# Altium project DriverBoard.PrjPcb
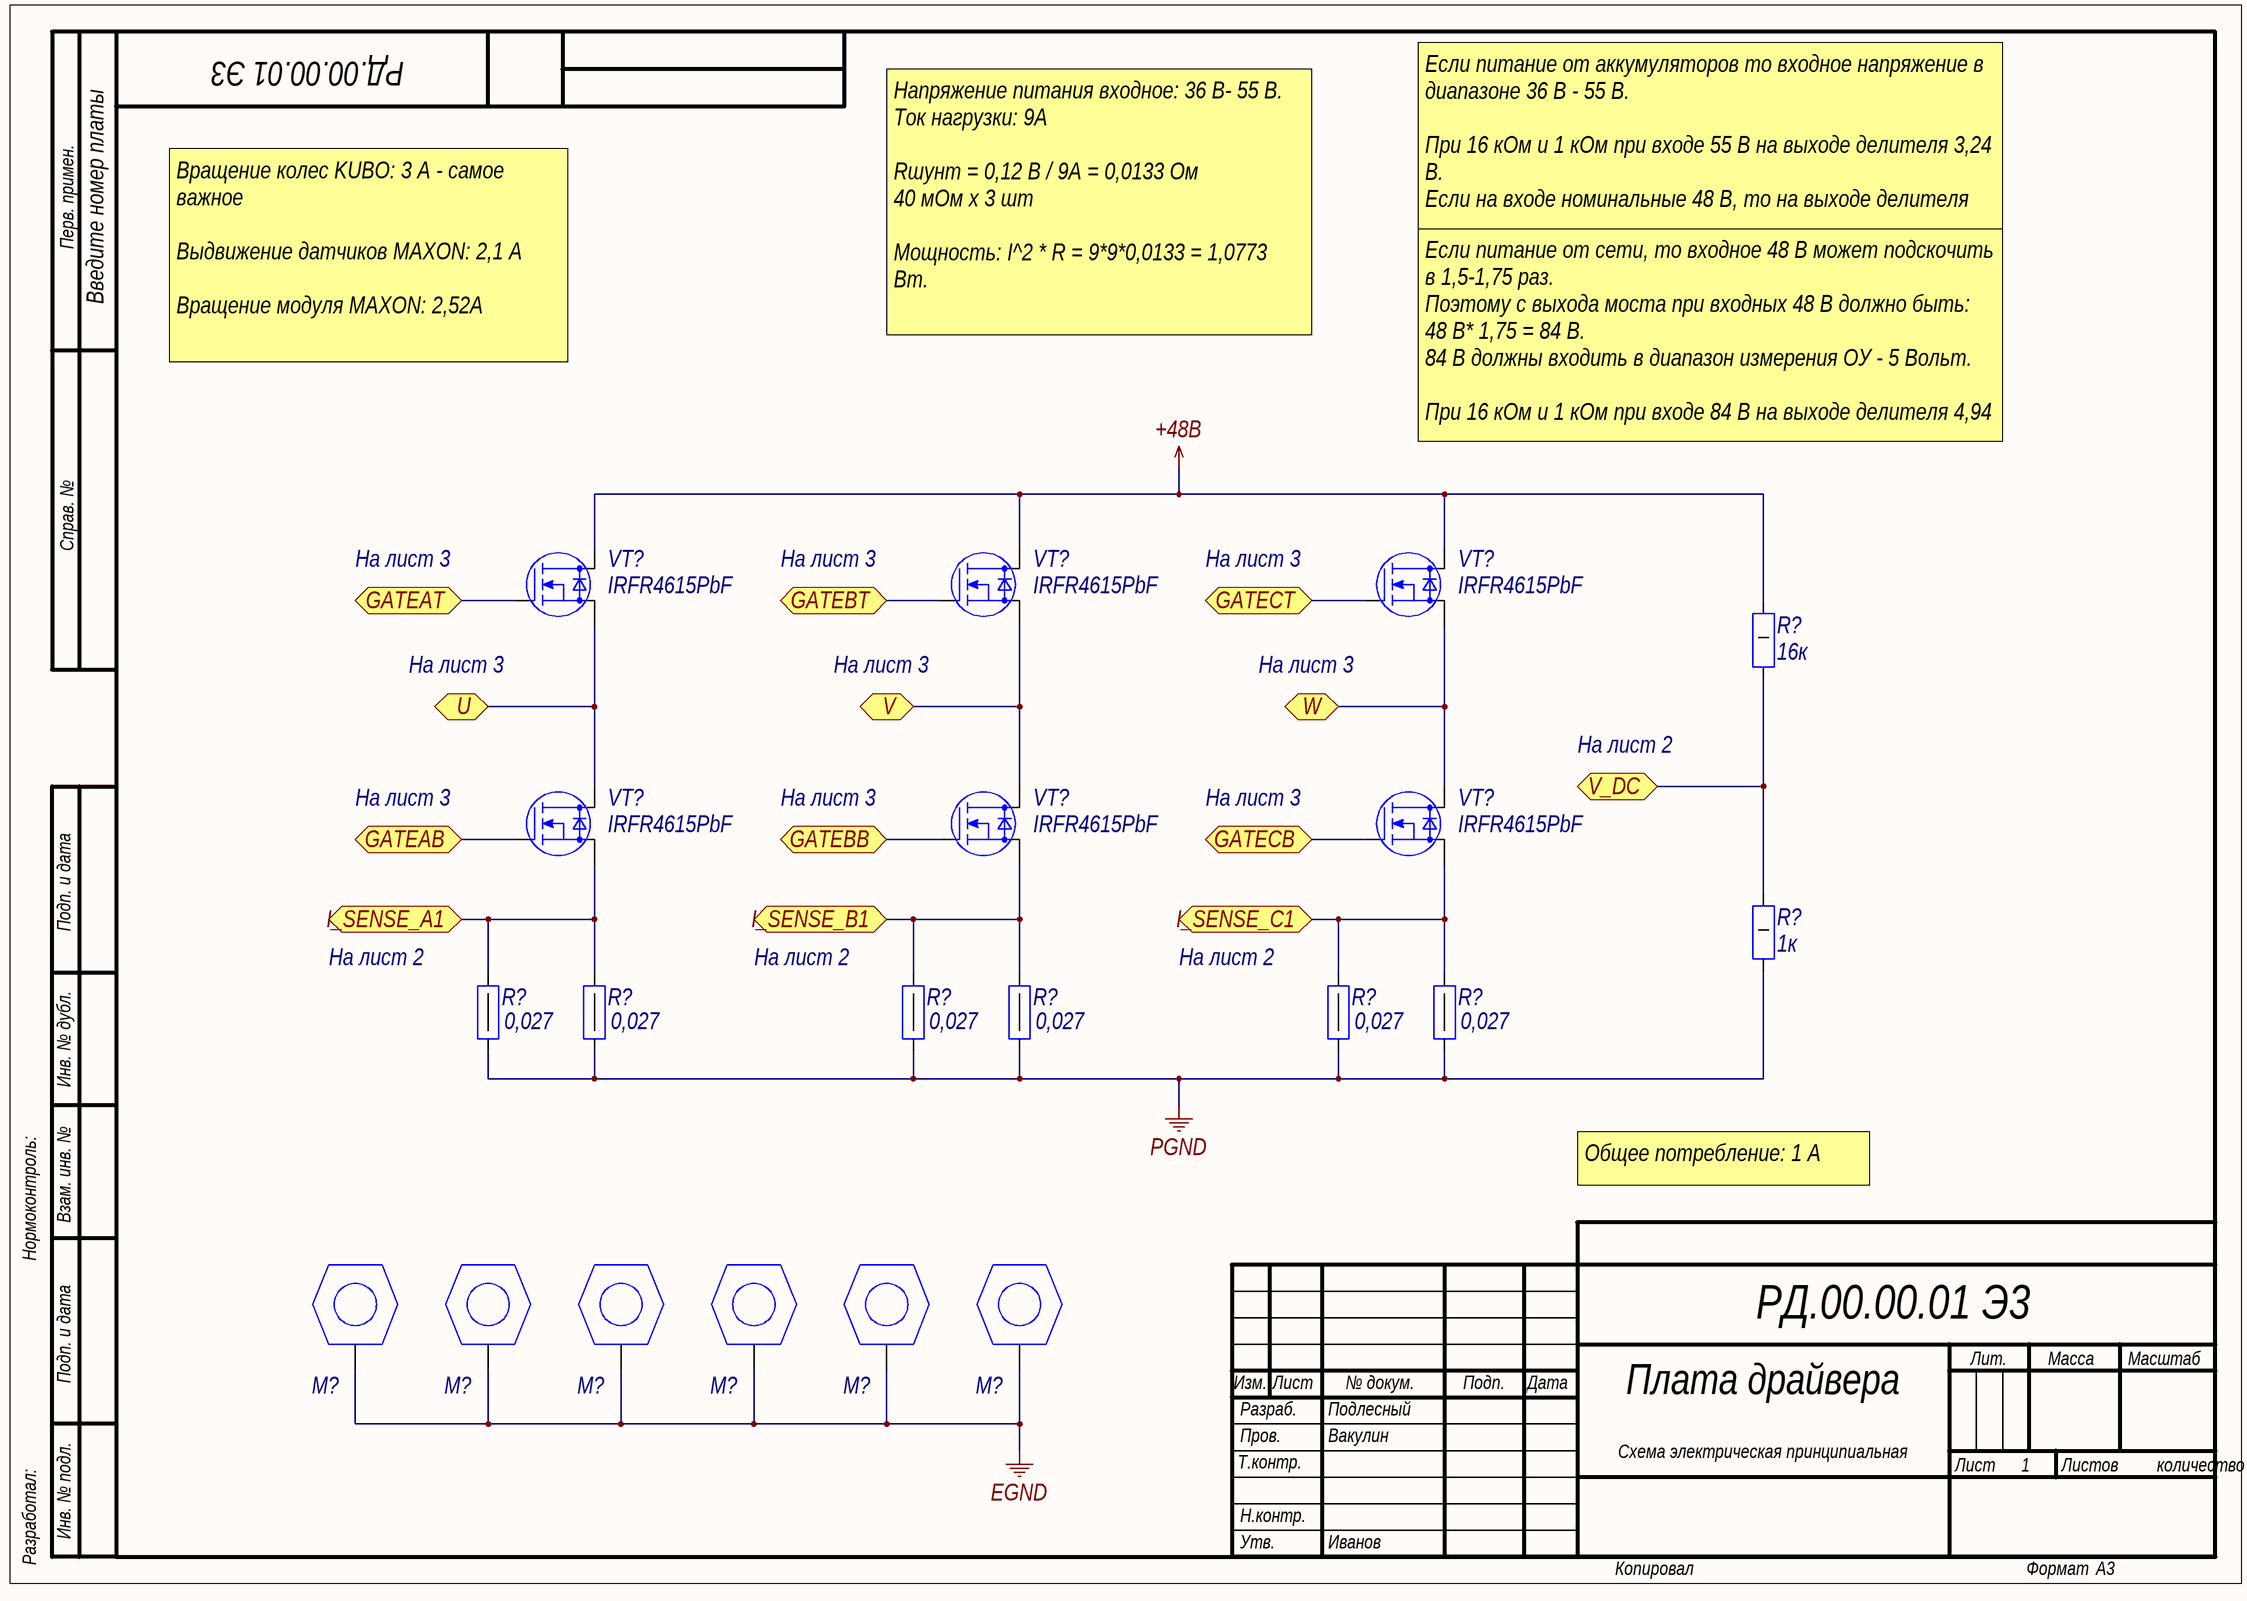
[diagram p0: DriverBoard_Bridge.SchDoc]
5 sheets, 143 parts. Net scope: flat (ports and power ports of the same name join across sheets).
Board file: DriverBoard.PcbDoc
Sheets:
  DriverBoard_Bridge.SchDoc
  DriverBoard_Amp.SchDoc
  DriverBoard_Driver.SchDoc
  DriverBoard_MCU.SchDoc
  DriverBoard_DC.SchDoc

## Sheet DriverBoard_Bridge.SchDoc: Плата драйвера
size 420 x 297 mm; ApprovedBy: Иванов; CheckedBy: Вакулин; DrawnBy: Подлесный; DocumentNumber: РД.00.00.01 Э3; SheetNumber: 1; SheetTotal: количество листов; DocumentType: Схема электрическая принципиальная; Format: A3; ImagePath: Введите номер платы

### Parts
(Parts that share a designator on the sheet are numbered #1, #2 ... from top to bottom, then left to right.)
M?#1  SCREW  [SCREW3]  (value not drawn)
M?#2  SCREW  [SCREW3]  (value not drawn)
M?#3  SCREW  [SCREW3]  (value not drawn)
M?#4  SCREW  [SCREW3]  (value not drawn)
M?#5  SCREW  [SCREW3]  (value not drawn)
M?#6  SCREW  [SCREW3]  (value not drawn)
R?#1  value 16к  [R2512]  (hidden comment: Resistor_1Вт)
R?#2  value 1к  [R2512]  (hidden comment: Resistor_1Вт)
R?#3  value 0,027  [R2010]  (hidden comment: Resistor_0,5Вт)
R?#4  value 0,027  [R2010]  (hidden comment: Resistor_0,5Вт)
R?#5  value 0,027  [R2010]  (hidden comment: Resistor_0,5Вт)
R?#6  value 0,027  [R2010]  (hidden comment: Resistor_0,5Вт)
R?#7  value 0,027  [R2010]  (hidden comment: Resistor_0,5Вт)
R?#8  value 0,027  [R2010]  (hidden comment: Resistor_0,5Вт)
VT?#1  Part Number: IRFR4615PbF  [DPAK]  (hidden comment: N-MOSFET)
VT?#2  Part Number: IRFR4615PbF  [DPAK]  (hidden comment: N-MOSFET)
VT?#3  Part Number: IRFR4615PbF  [DPAK]  (hidden comment: N-MOSFET)
VT?#4  Part Number: IRFR4615PbF  [DPAK]  (hidden comment: N-MOSFET)
VT?#5  Part Number: IRFR4615PbF  [DPAK]  (hidden comment: N-MOSFET)
VT?#6  Part Number: IRFR4615PbF  [DPAK]  (hidden comment: N-MOSFET)

### Ports
GATEAB, GATEAT, GATEBB, GATEBT, GATECB, GATECT, I_SENSE_A1, I_SENSE_B1, I_SENSE_C1, U, V, V_DC, W

### Nets
+48B: R?#1.2 VT?#1.2(D) VT?#2.2(D) VT?#3.2(D)
EGND: M?#1.1 M?#2.1 M?#3.1 M?#4.1 M?#5.1 M?#6.1
PGND: R?#2.1 R?#3.1 R?#4.1 R?#5.1 R?#6.1 R?#7.1 R?#8.1
NetC?#20_2: VT?#1.3(S) VT?#4.2(D) ; port U
NetC?#23_2: VT?#2.3(S) VT?#5.2(D) ; port V
NetC?#26_2: VT?#3.3(S) VT?#6.2(D) ; port W
NetR?#1_1: R?#1.1 R?#2.2 ; port V_DC
NetR?#3_2: R?#3.2 R?#4.2 VT?#4.3(S) ; port I_SENSE_A1
NetR?#5_2: R?#5.2 R?#6.2 VT?#5.3(S) ; port I_SENSE_B1
NetR?#7_2: R?#7.2 R?#8.2 VT?#6.3(S) ; port I_SENSE_C1
NetR?#29_2: VT?#1.1(G) ; port GATEAT
NetR?#30_2: VT?#4.1(G) ; port GATEAB
NetR?#33_2: VT?#2.1(G) ; port GATEBT
NetR?#34_2: VT?#5.1(G) ; port GATEBB
NetR?#37_2: VT?#3.1(G) ; port GATECT
NetR?#38_2: VT?#6.1(G) ; port GATECB

### Notes on the sheet
- Перв. примен.
- Если питание от аккумуляторов то входное напряжение в диапазоне 36 В - 55 B.
  При 16 кОм и 1 кОм при входе 55 В на выходе делителя 3,24 В.
  Если на входе номинальные 48 В, то на выходе делителя 2,82 В.
  Если на входе 36 В, то на выходе делителя 2,12 В.
- Напряжение питания входное: 36 B- 55 В.
  Ток нагрузки: 9А
  Rшунт = 0,12 B / 9A = 0,0133 Ом
  40 мОм х 3 шт
  Мощность: I^2 * R = 9*9*0,0133 = 1,0773 Вт.
- Вращение колес KUBO: 3 А - самое важное
  Выдвижение датчиков MAXON: 2,1 А
  Вращение модуля MAXON: 2,52А
  Выдвижение УЗ датчика MAXON: 0,748А
- Если питание от сети, то входное 48 В может подскочить в 1,5-1,75 раз.
  Поэтому с выхода моста при входных 48 В должно быть:
  48 В* 1,75 = 84 В.
  84 В должны входить в диапазон измерения ОУ - 5 Вольт.
  При 16 кОм и 1 кОм при входе 84 В на выходе делителя 4,94 В.
- Справ. №
- На лист 3
- (near VT?#1) На лист 3
- (near VT?#2) На лист 3
- (near VT?#3) На лист 3
- На лист 2
- Подп. и дата
- (near R?#3) На лист 2
- (near R?#5) На лист 2
- (near R?#7) На лист 2
- Инв. № дубл.
- Нормоконтроль:
- Взам. инв. №
- Общее потребление: 1 A
- Изм.
- Лист
- № докум.
- Подп.
- Дата
- Лит.
- Масса
- Масштаб
- Т.контр.
- Пров.
- Разраб.
- Листов
- Разработал:
- Инв. № подл.
- Н.контр.
- Утв.
- Копировал
- Формат

### Library data of the parts
M?#1-M?#6 = connect89: Part Name: Винт М3 с заземлением; id: connect89
R?#1 = res879: Резистор; Manufacture: Yageo; Part Number: RC2512FR-0716KL; id: res879; Accuracy: 0,01; Power: 1Вт; Part Name: Resistor
R?#2 = res850: Резистор; Manufacture: Yageo; Part Number: RC2512FR-071KL; id: res850; Accuracy: 0,01; Power: 1Вт; Part Name: Resistor
R?#3-R?#8 = res1151: Резистор; Part Name: Shunt; Manufacture: Yageo; Part Number: RL2010FK-070R027L; Accuracy: 0,01; Power: 0,75Вт; id: res1151
VT?#1-VT?#6 = mosfert20: Manufacturer: International Rectifier; Structure: n-channel; V drain-source max: 150B; Rds: 0,042Ohm; Gate-to-source voltage: (+-)20B; Continuous drain current: 33A; Total gate charge: 26nC; Pulsed drain current: 140A; Power dissipation: 144W; id: mosfert20

## Sheet DriverBoard_Amp.SchDoc
size 594 x 420 mm; DocumentNumber: РД.00.00.01 Э3; SheetNumber: 2; Format: A2
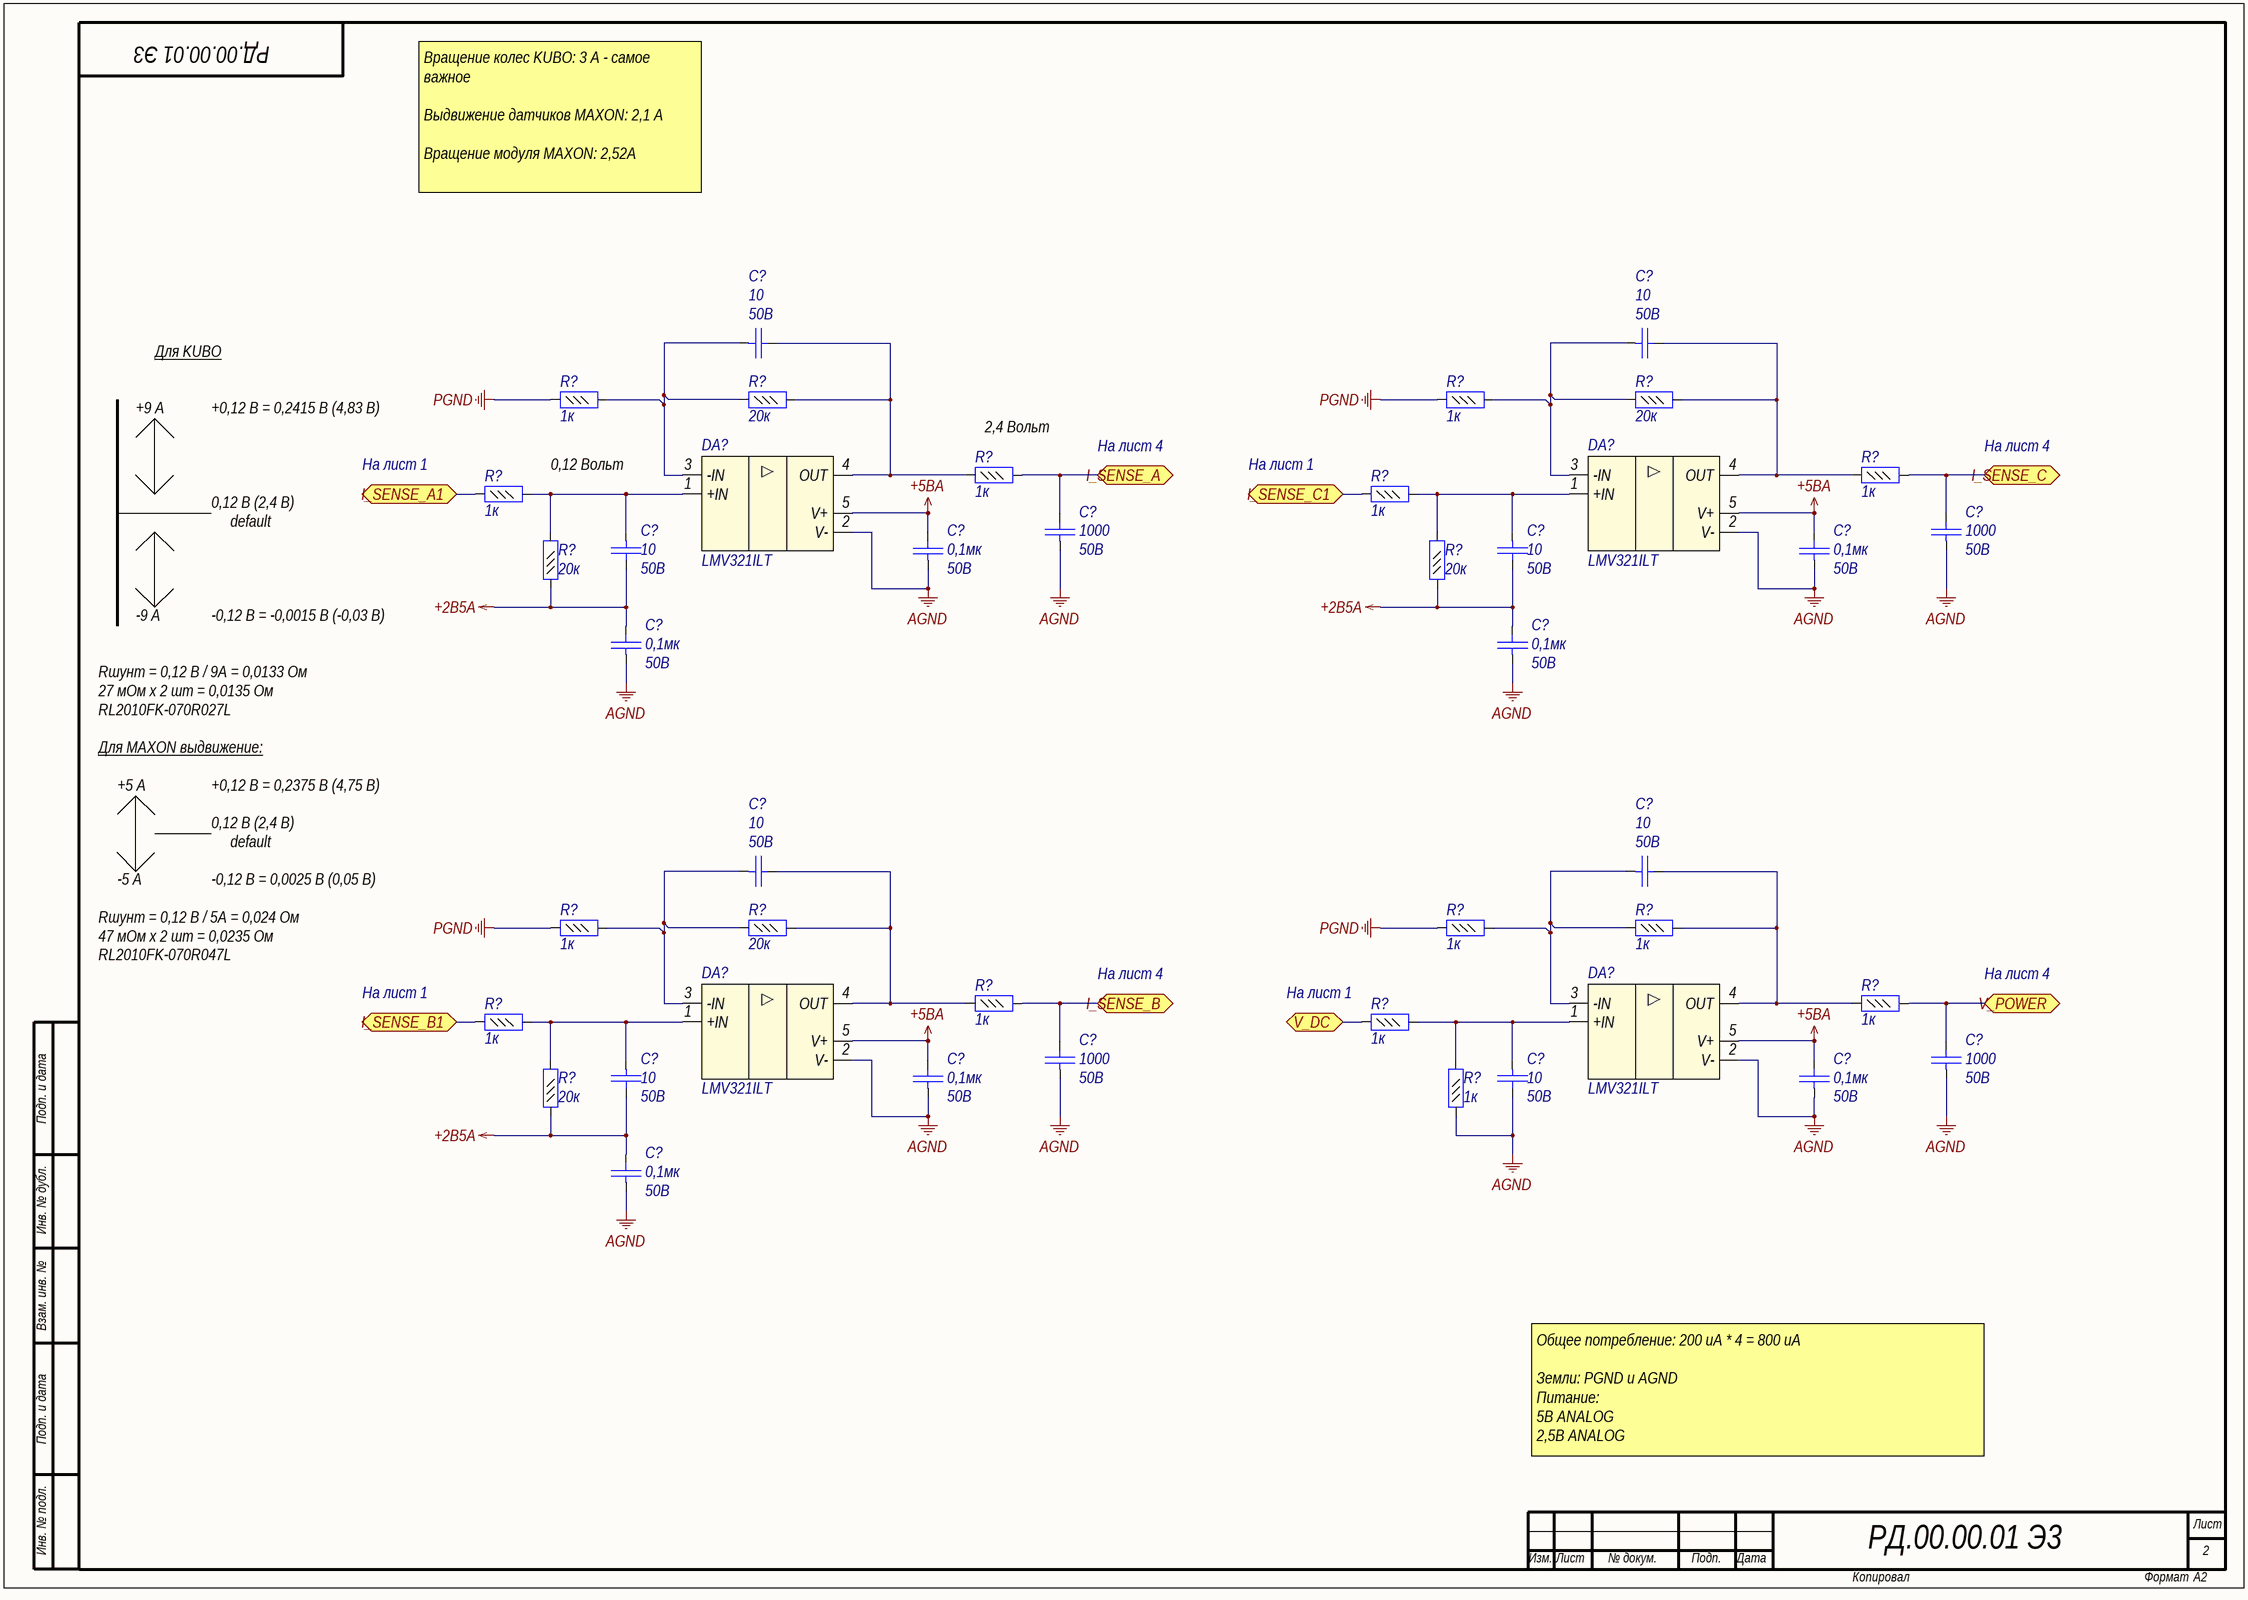
[diagram p1: DriverBoard_Amp.SchDoc]

### Parts
(Parts that share a designator on the sheet are numbered #1, #2 ... from top to bottom, then left to right.)
C?#1  value 10  Voltage: 50B  [C0402]  (hidden comment: Capacitor)
C?#2  value 10  Voltage: 50B  [C0402]  (hidden comment: Capacitor)
C?#3  value 10  Voltage: 50B  [C0402]  (hidden comment: Capacitor)
C?#4  value 10  Voltage: 50B  [C0402]  (hidden comment: Capacitor)
C?#5  value 1000  Voltage: 50B  [C0402]  (hidden comment: Capacitor)
C?#6  value 1000  Voltage: 50B  [C0402]  (hidden comment: Capacitor)
C?#7  value 0,1мк  Voltage: 50В  [C0402]  (hidden comment: Capacitor)
C?#8  value 0,1мк  Voltage: 50В  [C0402]  (hidden comment: Capacitor)
C?#9  value 0,1мк  Voltage: 50В  [C0402]  (hidden comment: Capacitor)
C?#10  value 0,1мк  Voltage: 50В  [C0402]  (hidden comment: Capacitor)
C?#11  value 10  Voltage: 50B  [C0402]  (hidden comment: Capacitor)
C?#12  value 10  Voltage: 50B  [C0402]  (hidden comment: Capacitor)
C?#13  value 10  Voltage: 50B  [C0402]  (hidden comment: Capacitor)
C?#14  value 10  Voltage: 50B  [C0402]  (hidden comment: Capacitor)
C?#15  value 1000  Voltage: 50B  [C0402]  (hidden comment: Capacitor)
C?#16  value 1000  Voltage: 50B  [C0402]  (hidden comment: Capacitor)
C?#17  value 0,1мк  Voltage: 50В  [C0402]  (hidden comment: Capacitor)
C?#18  value 0,1мк  Voltage: 50В  [C0402]  (hidden comment: Capacitor)
C?#19  value 0,1мк  Voltage: 50В  [C0402]  (hidden comment: Capacitor)
DA?#1  LMV321ILT  [SOT23-5]
DA?#2  LMV321ILT  [SOT23-5]
DA?#3  LMV321ILT  [SOT23-5]
DA?#4  LMV321ILT  [SOT23-5]
R?#9  value 1к  [R0402]  (hidden comment: Resistor_0,062Вт)
R?#10  value 20к  [R0402]  (hidden comment: Resistor_0,062Вт)
R?#11  value 1к  [R0402]  (hidden comment: Resistor_0,062Вт)
R?#12  value 20к  [R0402]  (hidden comment: Resistor_0,062Вт)
R?#13  value 1к  [R0402]  (hidden comment: Resistor_0,062Вт)
R?#14  value 1к  [R0402]  (hidden comment: Resistor_0,062Вт)
R?#15  value 1к  [R0402]  (hidden comment: Resistor_0,062Вт)
R?#16  value 1к  [R0402]  (hidden comment: Resistor_0,062Вт)
R?#17  value 20к  [R0402]  (hidden comment: Resistor_0,062Вт)
R?#18  value 20к  [R0402]  (hidden comment: Resistor_0,062Вт)
R?#19  value 1к  [R0402]  (hidden comment: Resistor_0,062Вт)
R?#20  value 20к  [R0402]  (hidden comment: Resistor_0,062Вт)
R?#21  value 1к  [R0402]  (hidden comment: Resistor_0,062Вт)
R?#22  value 1к  [R0402]  (hidden comment: Resistor_0,062Вт)
R?#23  value 1к  [R0402]  (hidden comment: Resistor_0,062Вт)
R?#24  value 1к  [R0402]  (hidden comment: Resistor_0,062Вт)
R?#25  value 1к  [R0402]  (hidden comment: Resistor_0,062Вт)
R?#26  value 1к  [R0402]  (hidden comment: Resistor_0,062Вт)
R?#27  value 20к  [R0402]  (hidden comment: Resistor_0,062Вт)
R?#28  value 1к  [R0402]  (hidden comment: Resistor_0,062Вт)

### Ports
I_SENSE_A, I_SENSE_A1, I_SENSE_B, I_SENSE_B1, I_SENSE_C, I_SENSE_C1, V_DC, V_POWER

### Nets
+2B5A: C?#3.2 C?#4.2 C?#9.2 C?#10.2 C?#13.2 C?#19.2 R?#17.1 R?#18.1 R?#27.1
+5BA: C?#7.2 C?#8.2 C?#17.2 C?#18.2 DA?#1.5(V+) DA?#2.5(V+) DA?#3.5(V+) DA?#4.5(V+)
AGND: C?#5.1 C?#6.1 C?#7.1 C?#8.1 C?#9.1 C?#10.1 C?#14.2 C?#15.1 C?#16.1 C?#17.1 C?#18.1 C?#19.1 DA?#1.2(V-) DA?#2.2(V-) DA?#3.2(V-) DA?#4.2(V-) R?#28.1
PGND: R?#9.1 R?#11.1 R?#19.1 R?#21.1
NetC?#1_1: C?#1.1 DA?#1.3(-IN) R?#9.2 R?#10.1
NetC?#1_2: C?#1.2 DA?#1.4(OUT) R?#10.2 R?#13.1
NetC?#2_1: C?#2.1 DA?#2.3(-IN) R?#11.2 R?#12.1
NetC?#2_2: C?#2.2 DA?#2.4(OUT) R?#12.2 R?#14.1
NetC?#3_1: C?#3.1 DA?#1.1(+IN) R?#15.2 R?#17.2
NetC?#4_1: C?#4.1 DA?#2.1(+IN) R?#16.2 R?#18.2
NetC?#5_2: C?#5.2 R?#13.2 ; port I_SENSE_A
NetC?#6_2: C?#6.2 R?#14.2 ; port I_SENSE_C
NetC?#11_1: C?#11.1 DA?#3.3(-IN) R?#19.2 R?#20.1
NetC?#11_2: C?#11.2 DA?#3.4(OUT) R?#20.2 R?#23.1
NetC?#12_1: C?#12.1 DA?#4.3(-IN) R?#21.2 R?#22.1
NetC?#12_2: C?#12.2 DA?#4.4(OUT) R?#22.2 R?#24.1
NetC?#13_1: C?#13.1 DA?#3.1(+IN) R?#25.2 R?#27.2
NetC?#14_1: C?#14.1 DA?#4.1(+IN) R?#26.2 R?#28.2
NetC?#15_2: C?#15.2 R?#23.2 ; port I_SENSE_B
NetC?#16_2: C?#16.2 R?#24.2 ; port V_POWER
NetR?#1_1: R?#26.1 ; port V_DC
NetR?#3_2: R?#15.1 ; port I_SENSE_A1
NetR?#5_2: R?#25.1 ; port I_SENSE_B1
NetR?#7_2: R?#16.1 ; port I_SENSE_C1

### Notes on the sheet
- Вращение колес KUBO: 3 А - самое важное
  Выдвижение датчиков MAXON: 2,1 А
  Вращение модуля MAXON: 2,52А
  Выдвижение УЗ датчика MAXON: 0,748А
- Для KUBO
- +9 А
- +0,12 B = 0,2415 B (4,83 B)
- (near R?#13) 2,4 Вольт
- На лист 4
- На лист 1
- (near R?#15) 0,12 Вольт
- 0,12 B (2,4 B)
- default
- -9 А
- -0,12 B = -0,0015 B (-0,03 B)
- Rшунт = 0,12 B / 9A = 0,0133 Ом
- 27 мОм х 2 шт = 0,0135 Ом
- RL2010FK-070R027L
- Для МAXON выдвижение:
- +5 А
- +0,12 B = 0,2375 B (4,75 B)
- -5 А
- -0,12 B = 0,0025 B (0,05 B)
- Rшунт = 0,12 B / 5A = 0,024 Ом
- 47 мОм х 2 шт = 0,0235 Ом
- RL2010FK-070R047L
- (near R?#26) На лист 1
- Подп. и дата
- Инв. № дубл.
- Взам. инв. №
- Общее потребление: 200 uA * 4 = 800 uA
  Земли: PGND и AGND
  Питание:
  5В ANALOG
  2,5B ANALOG
- Инв. № подл.
- Лист
- Изм.
- № докум.
- Подп.
- Дата
- Копировал
- Формат

### Library data of the parts
C?#1-C?#4 C?#11-C?#14 = cap5: Конденсатор; Part Name: Ceramic; Manufacture: Murata; Part Number: GRM1535C1H100J; id: cap5; TKE: NP0
C?#5 C?#6 C?#15 C?#16 = cap28: Конденсатор; Part Name: Ceramic; Manufacture: Murata; Part Number: GRM1555C1H102J; id: cap28; TKE: NP0
C?#7-C?#10 C?#17-C?#19 = cap277: Конденсатор; Part Name: Ceramic; Manufacture: Murata; Part Number: GRM155R71H104KE14D; id: cap277; TKE: X7R; tga: 0,10%
DA?#1-DA?#4 = amp10: HIGH-DRIVE OPERATIONAL AMPLIFIERS WITH SHUTDOWN; Part Name: Micropower / Operational Amplifiers; Manufacture: ST Microelectronics; id: amp10; Rail-to-rail: yes; Supply Voltage: 2,7-6B; Supply Current max: 200uA; Bandwidth: 1MHz; Input Bias Current: 10nA; CMRR: 85dB; PSRR: 80dB; Offset voltage: 0,1mB; Channels: 1; Part Number: LMV321ILT
R?#9 R?#11 R?#13-R?#16 R?#19 R?#21-R?#26 R?#28 = res270: Резистор; Manufacture: Yageo; Part Number: RC0402FR-071KL; id: res270; Accuracy: 0,01; Part Name: Resistor; Power: 0,062Вт
R?#10 R?#12 R?#17 R?#18 R?#20 R?#27 = res301: Резистор; Manufacture: Yageo; Part Number: RC0402FR-0720KL; id: res301; Accuracy: 0,01; Part Name: Resistor; Power: 0,062Вт

## Sheet DriverBoard_Driver.SchDoc
size 420 x 297 mm; DocumentNumber: Введите номер платы + Э3; SheetNumber: номер страницы; Format: A3
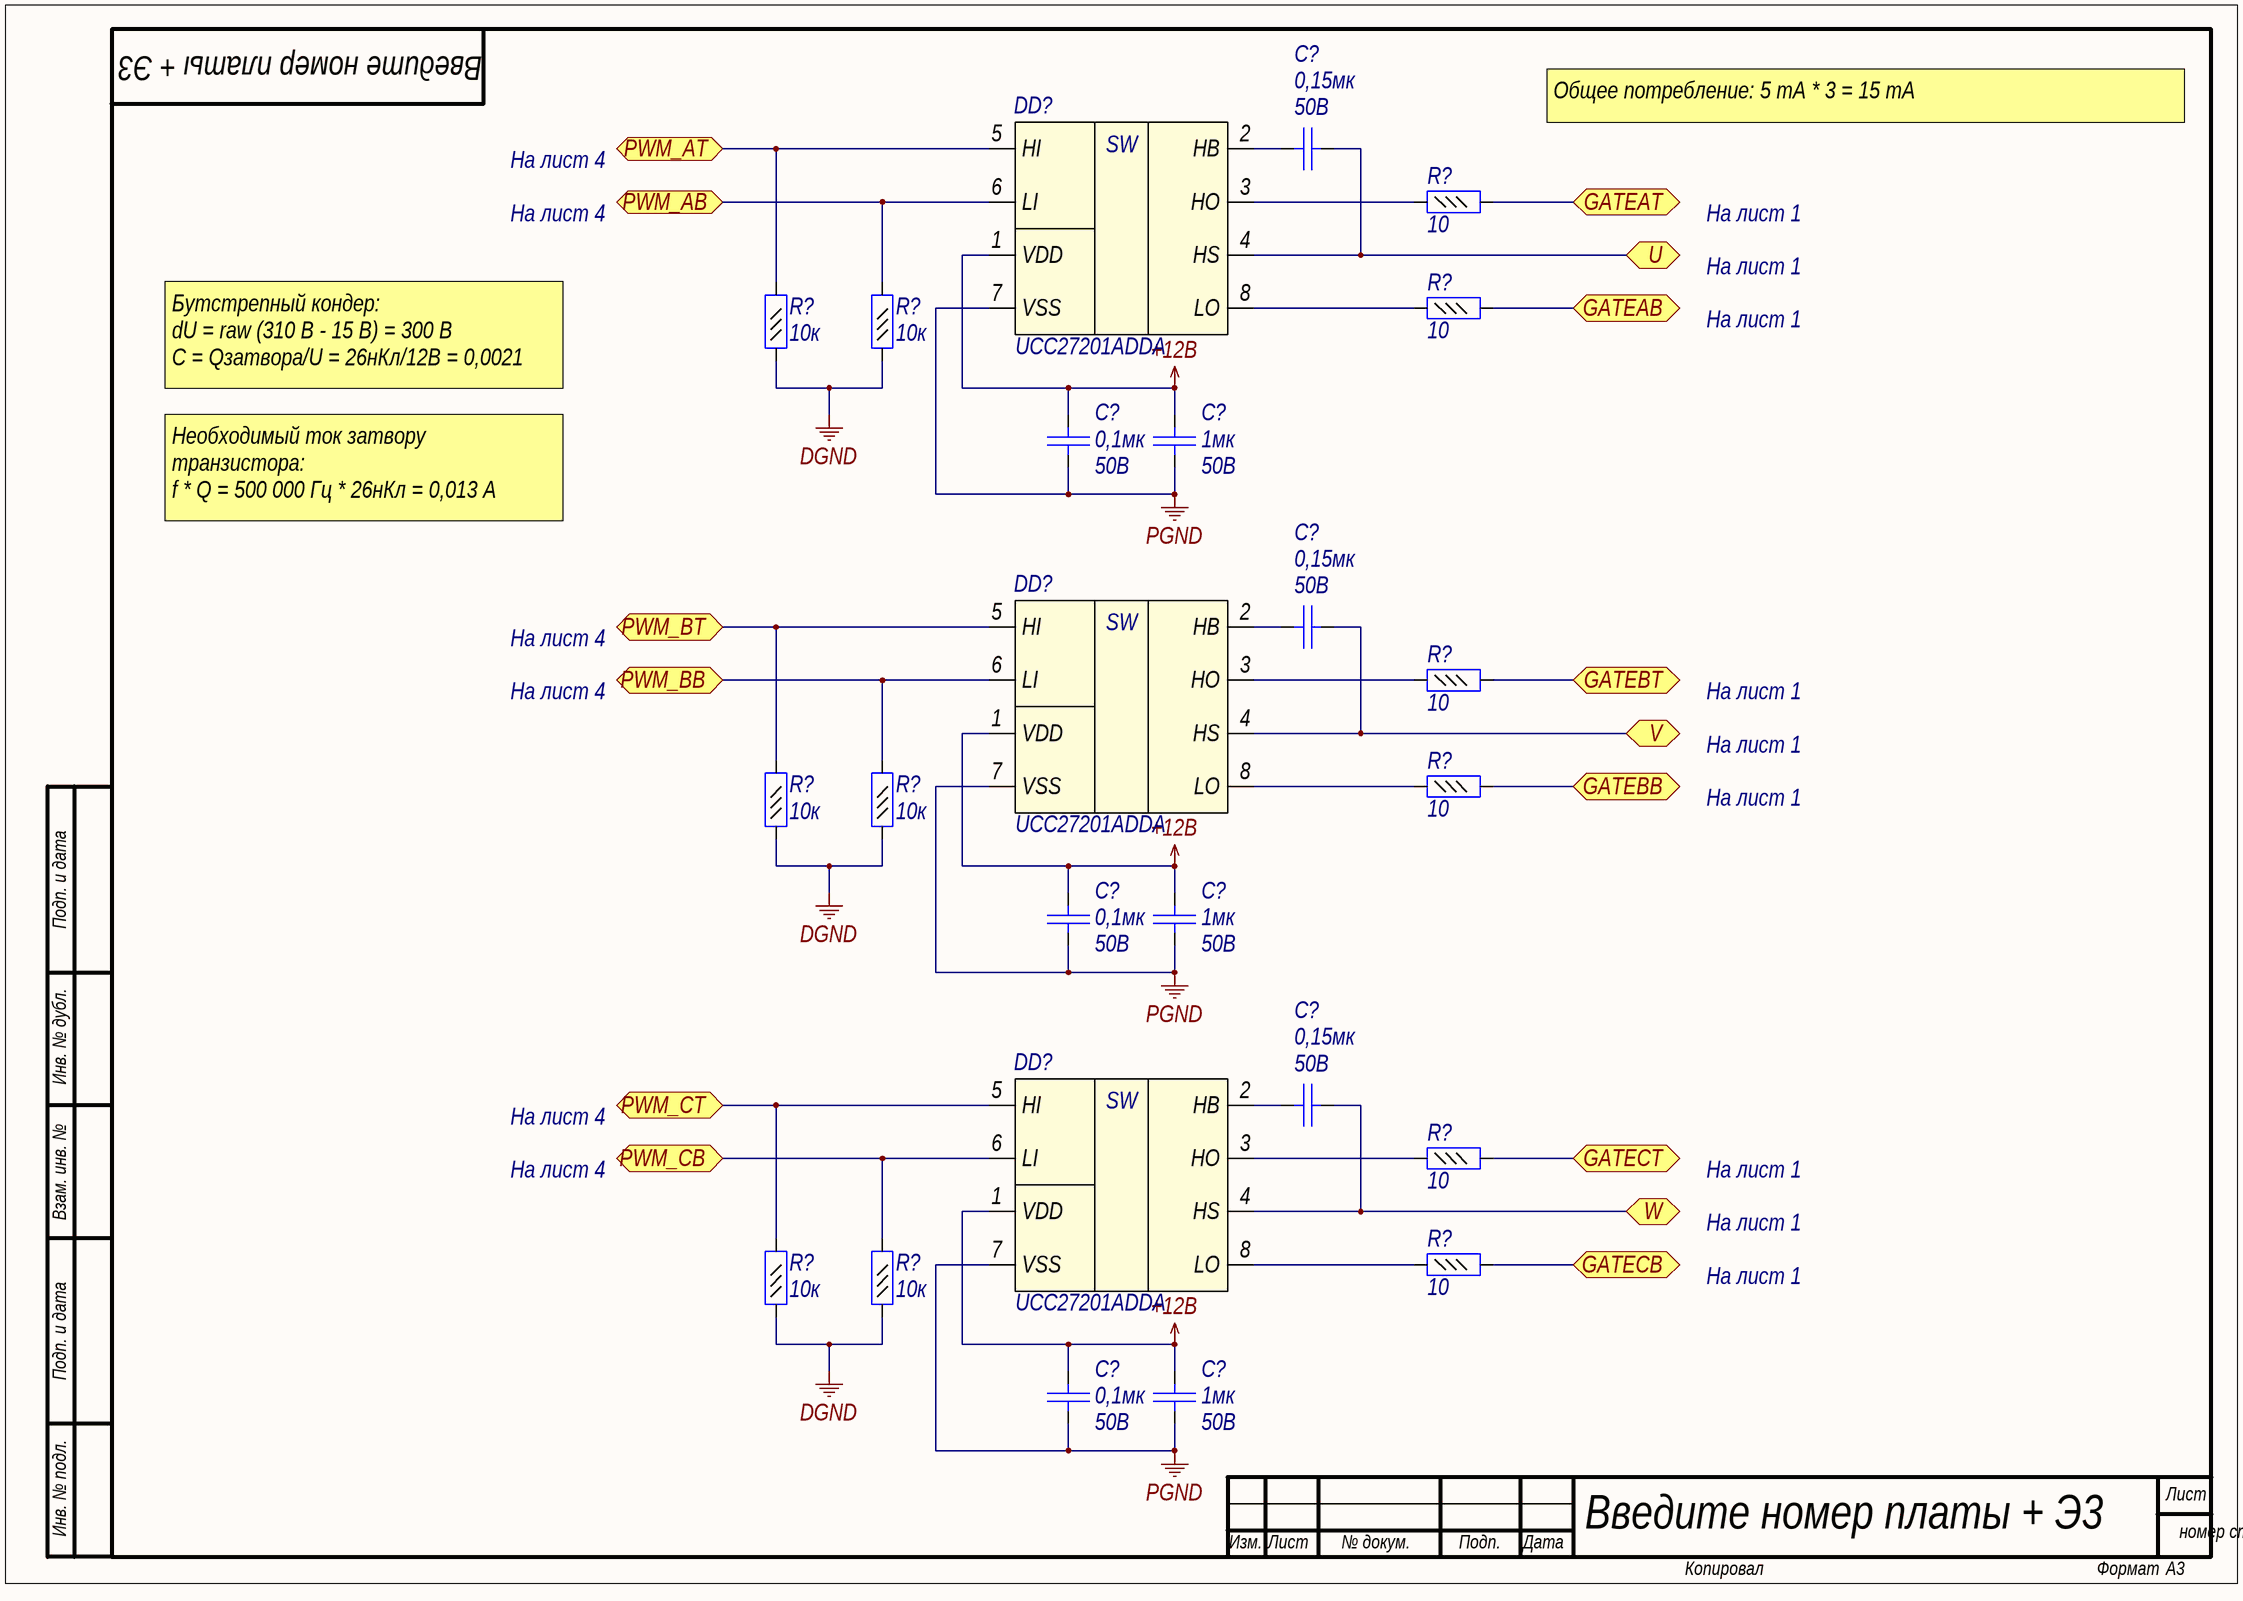
[diagram p2: DriverBoard_Driver.SchDoc]

### Parts
(Parts that share a designator on the sheet are numbered #1, #2 ... from top to bottom, then left to right.)
C?#20  value 0,15мк  Voltage: 50B  [C0603]  (hidden comment: Capacitor)
C?#21  value 0,1мк  Voltage: 50В  [C0402]  (hidden comment: Capacitor)
C?#22  value 1мк  Voltage: 50B  [C0805]  (hidden comment: Capacitor)
C?#23  value 0,15мк  Voltage: 50B  [C0603]  (hidden comment: Capacitor)
C?#24  value 0,1мк  Voltage: 50В  [C0402]  (hidden comment: Capacitor)
C?#25  value 1мк  Voltage: 50B  [C0805]  (hidden comment: Capacitor)
C?#26  value 0,15мк  Voltage: 50B  [C0603]  (hidden comment: Capacitor)
C?#27  value 0,1мк  Voltage: 50В  [C0402]  (hidden comment: Capacitor)
C?#28  value 1мк  Voltage: 50B  [C0805]  (hidden comment: Capacitor)
DD?#1  Part Number: UCC27201ADDA  [HSOP8]  (hidden comment: UCC27201A)
DD?#2  Part Number: UCC27201ADDA  [HSOP8]  (hidden comment: UCC27201A)
DD?#3  Part Number: UCC27201ADDA  [HSOP8]  (hidden comment: UCC27201A)
R?#29  value 10  [R0402]  (hidden comment: Resistor_0,062Вт)
R?#30  value 10  [R0402]  (hidden comment: Resistor_0,062Вт)
R?#31  value 10к  [R0402]  (hidden comment: Resistor_0,062Вт)
R?#32  value 10к  [R0402]  (hidden comment: Resistor_0,062Вт)
R?#33  value 10  [R0402]  (hidden comment: Resistor_0,062Вт)
R?#34  value 10  [R0402]  (hidden comment: Resistor_0,062Вт)
R?#35  value 10к  [R0402]  (hidden comment: Resistor_0,062Вт)
R?#36  value 10к  [R0402]  (hidden comment: Resistor_0,062Вт)
R?#37  value 10  [R0402]  (hidden comment: Resistor_0,062Вт)
R?#38  value 10  [R0402]  (hidden comment: Resistor_0,062Вт)
R?#39  value 10к  [R0402]  (hidden comment: Resistor_0,062Вт)
R?#40  value 10к  [R0402]  (hidden comment: Resistor_0,062Вт)

### Ports
GATEAB, GATEAT, GATEBB, GATEBT, GATECB, GATECT, PWM_AB, PWM_AT, PWM_BB, PWM_BT, PWM_CB, PWM_CT, U, V, W

### Nets
+12B: C?#21.2 C?#22.2 C?#24.2 C?#25.2 C?#27.2 C?#28.2 DD?#1.1(VDD) DD?#2.1(VDD) DD?#3.1(VDD)
DGND: R?#31.1 R?#32.1 R?#35.1 R?#36.1 R?#39.1 R?#40.1
PGND: C?#21.1 C?#22.1 C?#24.1 C?#25.1 C?#27.1 C?#28.1 DD?#1.7(VSS) DD?#2.7(VSS) DD?#3.7(VSS)
NetC?#20_1: C?#20.1 DD?#1.2(HB)
NetC?#20_2: C?#20.2 DD?#1.4(HS) ; port U
NetC?#23_1: C?#23.1 DD?#2.2(HB)
NetC?#23_2: C?#23.2 DD?#2.4(HS) ; port V
NetC?#26_1: C?#26.1 DD?#3.2(HB)
NetC?#26_2: C?#26.2 DD?#3.4(HS) ; port W
NetDD4_27: DD?#1.5(HI) R?#31.2 ; port PWM_AT
NetDD4_30: DD?#3.6(LI) R?#40.2 ; port PWM_CB
NetDD4_55: DD?#1.6(LI) R?#32.2 ; port PWM_AB
NetDD4_57: DD?#2.5(HI) R?#35.2 ; port PWM_BT
NetDD4_59: DD?#2.6(LI) R?#36.2 ; port PWM_BB
NetDD4_62: DD?#3.5(HI) R?#39.2 ; port PWM_CT
NetDD?#1_3: DD?#1.3(HO) R?#29.1
NetDD?#1_8: DD?#1.8(LO) R?#30.1
NetDD?#2_3: DD?#2.3(HO) R?#33.1
NetDD?#2_8: DD?#2.8(LO) R?#34.1
NetDD?#3_3: DD?#3.3(HO) R?#37.1
NetDD?#3_8: DD?#3.8(LO) R?#38.1
NetR?#29_2: R?#29.2 ; port GATEAT
NetR?#30_2: R?#30.2 ; port GATEAB
NetR?#33_2: R?#33.2 ; port GATEBT
NetR?#34_2: R?#34.2 ; port GATEBB
NetR?#37_2: R?#37.2 ; port GATECT
NetR?#38_2: R?#38.2 ; port GATECB

### Notes on the sheet
- Общее потребление: 5 mA * 3 = 15 mA
- На лист 4
- На лист 1
- Бутстрепный кондер:
  dU = raw (310 B - 15 B) = 300 B
  C = Qзатвора/U = 26нКл/12В = 0,0021 мкФ
- Необходимый ток затвору транзистора:
  f * Q = 500 000 Гц * 26нКл = 0,013 А
  Ток на затвор = 12В / 10 ом = 1,2 А
- Подп. и дата
- Инв. № дубл.
- Взам. инв. №
- Инв. № подл.
- Лист
- Изм.
- № докум.
- Подп.
- Дата
- Копировал
- Формат
- (in symbol driver25) SW

### Library data of the parts
C?#20 C?#23 C?#26 = cap132: Конденсатор; Part Name: Ceramic; Manufacture: Samsung Electro-Mechanics; Part Number: CL10B154KB8VPNC; id: cap132; TKE: X7R
C?#21 C?#24 C?#27 = cap277: as C?#7 on sheet DriverBoard_Amp
C?#22 C?#25 C?#28 = cap151: Конденсатор; Part Name: Ceramic; Manufacture: Murata; Part Number: GRM21BR71H105K; id: cap151; TKE: X7R
DD?#1-DD?#3 = driver25: 120-V Boot, 3-A Peak, High-Frequency, High-Side and Low-Side Driver; Part Name: High-Side/Low-Side Driver; Manufacture: Texas Instruments; Logic High: 1,6B-2,5B; Logic Low: 0,8B-1,6B; Min Operating Supply Voltage: 8B; Max Operating Supply Voltage: 17B; Vbus: 120B; “A” OUTPUT: Noninverting; Maximum output current: 3A; Maximum Power Dissipation: 2,7W; id: driver25; “B” OUTPUT: Noninverting
R?#29 R?#30 R?#33 R?#34 R?#37 R?#38 = res222: Резистор; Manufacture: Yageo; Part Number: RC0402FR-0710RL; id: res222; Accuracy: 0,01; Part Name: Resistor; Power: 0,062Вт
R?#31 R?#32 R?#35 R?#36 R?#39 R?#40 = res294: Резистор; Manufacture: Yageo; Part Number: RC0402FR-0710KL; id: res294; Accuracy: 0,01; Part Name: Resistor; Power: 0,062Вт

## Sheet DriverBoard_MCU.SchDoc
size 840 x 594 mm; DocumentNumber: Введите номер платы + Э3; SheetNumber: 4; Format: A1
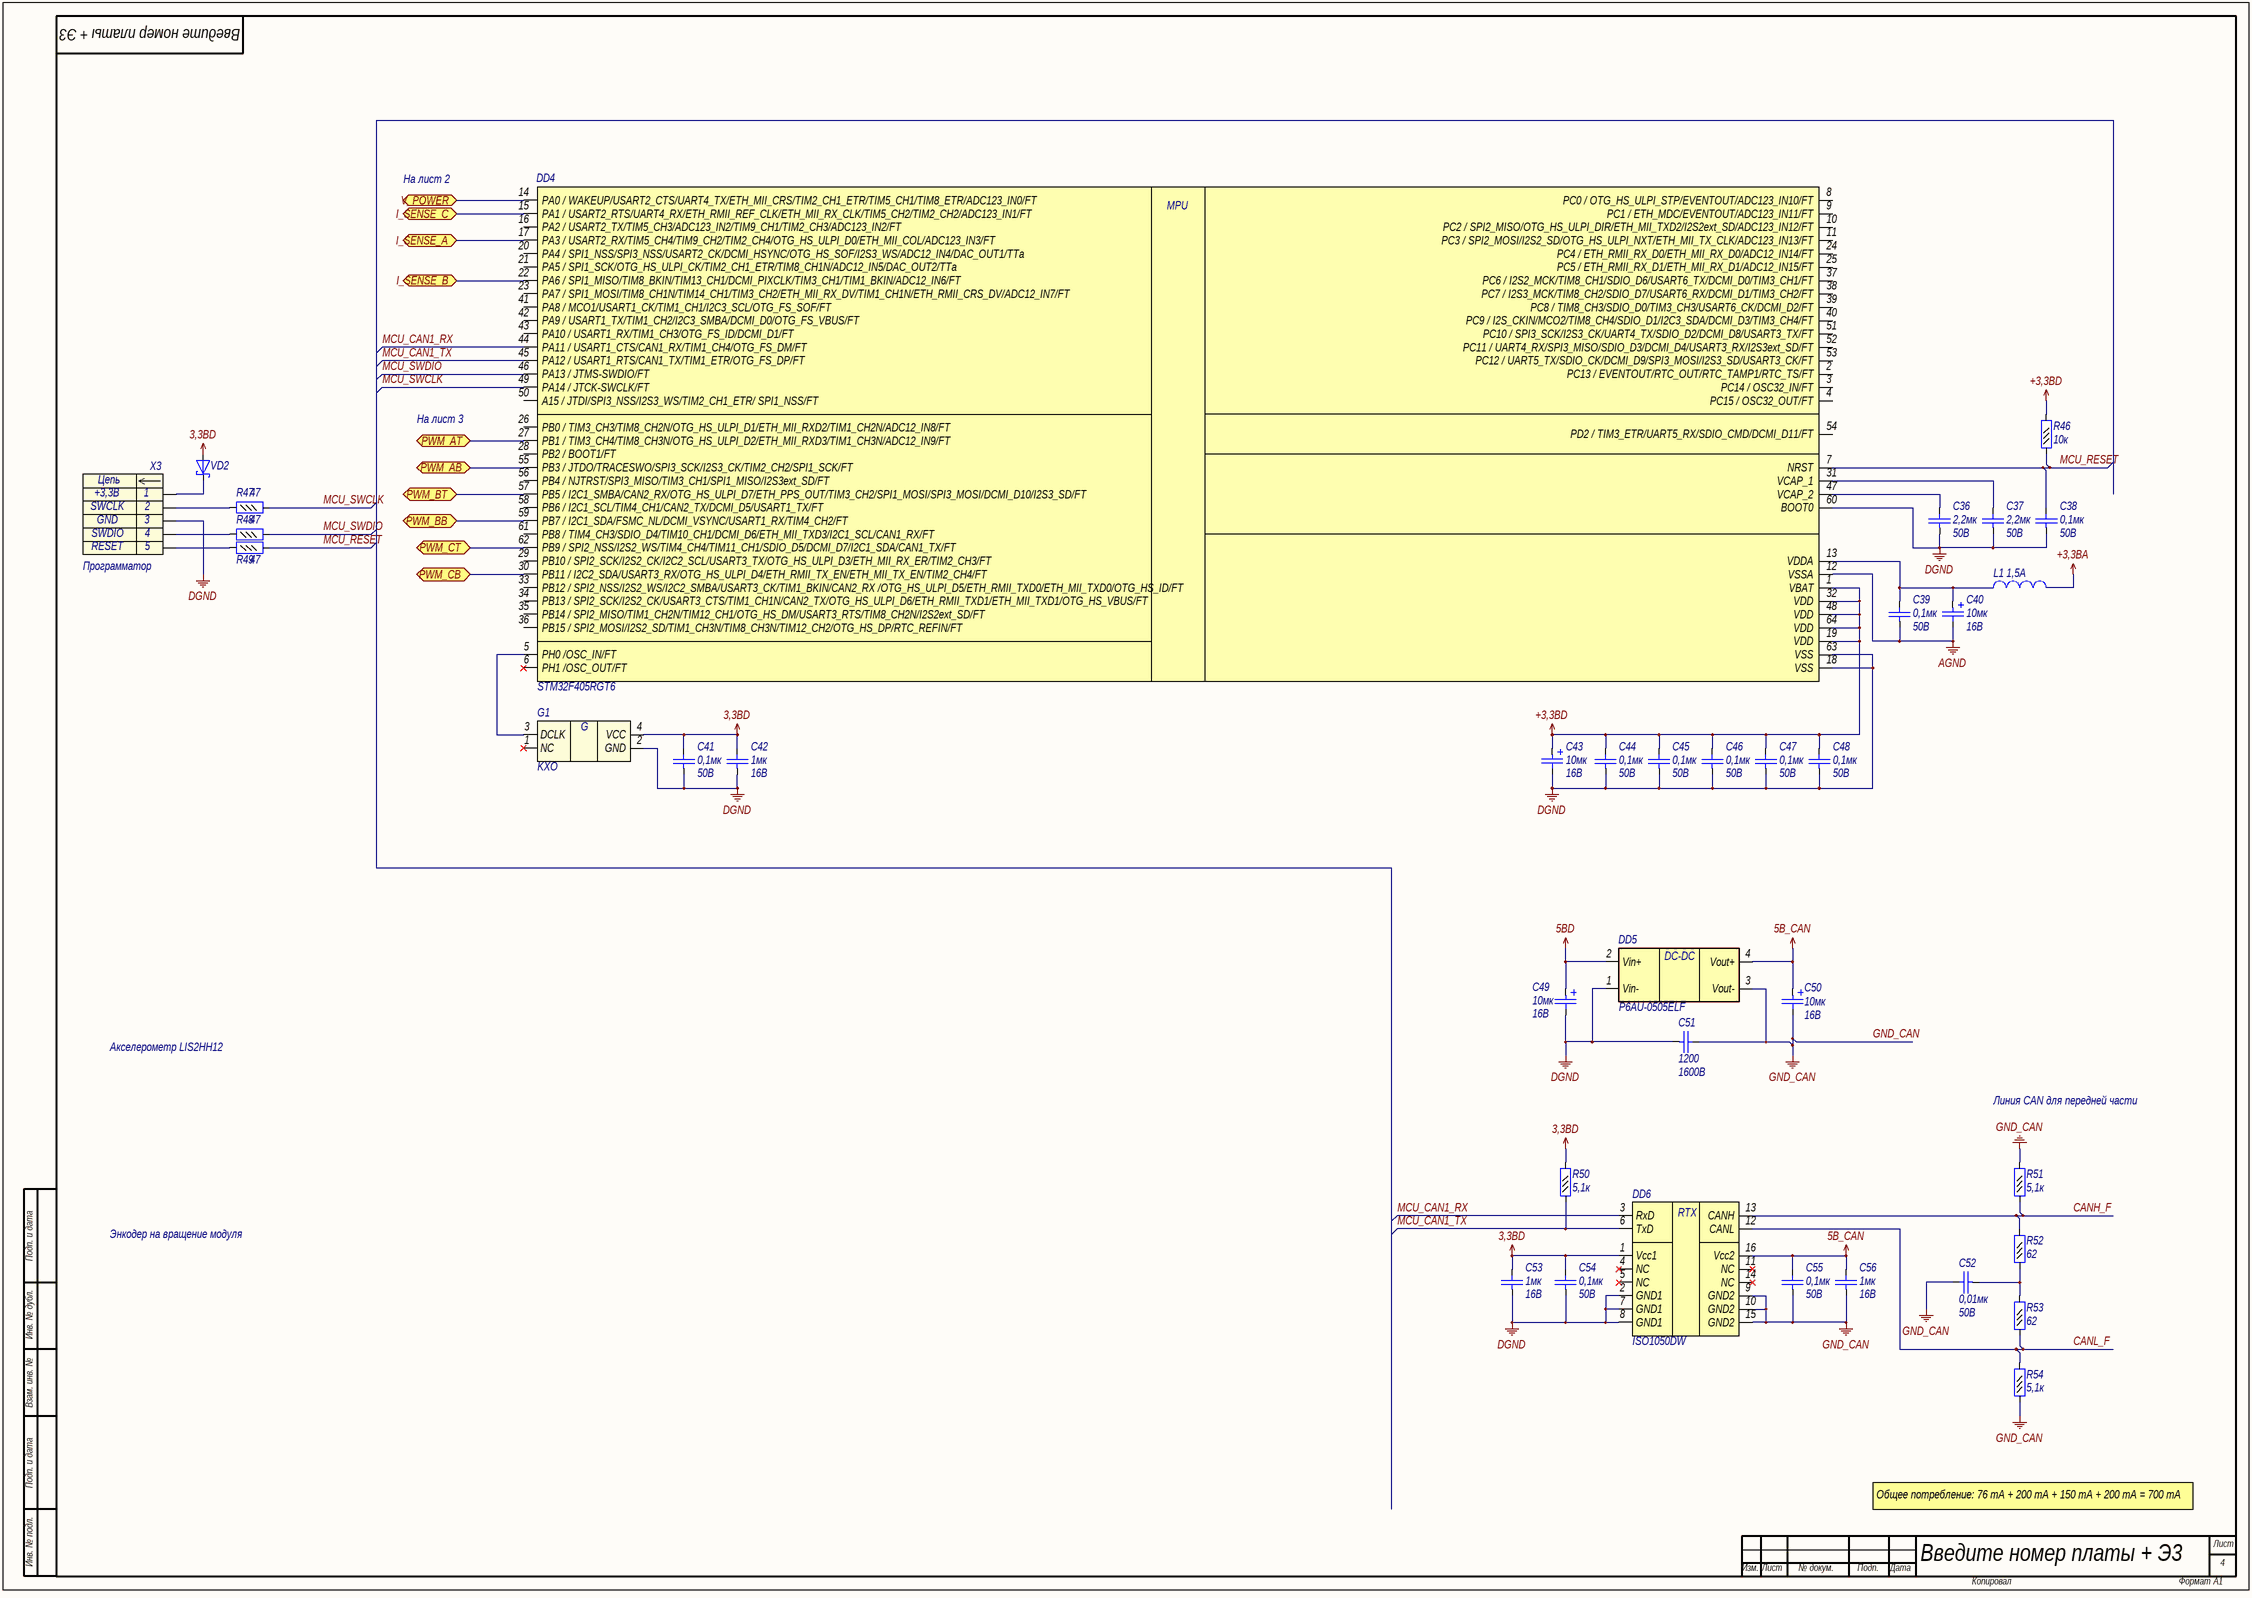
[diagram p3: DriverBoard_MCU.SchDoc]

### Parts
C36  value 2,2мк  Voltage: 50B  [C0603]  (hidden comment: Capacitor)
C37  value 2,2мк  Voltage: 50B  [C0603]  (hidden comment: Capacitor)
C38  value 0,1мк  Voltage: 50В  [C0402]  (hidden comment: Capacitor)
C39  value 0,1мк  Voltage: 50В  [C0402]  (hidden comment: Capacitor)
C40  value 10мк  Voltage: 16В  [TANTAL CASE A]  (hidden comment: Capacitor_pol)
C41  value 0,1мк  Voltage: 50В  [C0402]  (hidden comment: Capacitor)
C42  value 1мк  Voltage: 16B  [C0603]  (hidden comment: Capacitor)
C43  value 10мк  Voltage: 16В  [TANTAL CASE A]  (hidden comment: Capacitor_pol)
C44  value 0,1мк  Voltage: 50В  [C0402]  (hidden comment: Capacitor)
C45  value 0,1мк  Voltage: 50В  [C0402]  (hidden comment: Capacitor)
C46  value 0,1мк  Voltage: 50В  [C0402]  (hidden comment: Capacitor)
C47  value 0,1мк  Voltage: 50В  [C0402]  (hidden comment: Capacitor)
C48  value 0,1мк  Voltage: 50В  [C0402]  (hidden comment: Capacitor)
C49  value 10мк  Voltage: 16В  [TANTAL CASE A]  (hidden comment: Capacitor_pol)
C50  value 10мк  Voltage: 16В  [TANTAL CASE A]  (hidden comment: Capacitor_pol)
C51  value 1200  Voltage: 1600B  [K78-2]  (hidden comment: Capacitor)
C52  value 0,01мк  Voltage: 50B  [C0603]  (hidden comment: Capacitor)
C53  value 1мк  Voltage: 16B  [C0603]  (hidden comment: Capacitor)
C54  value 0,1мк  Voltage: 50B  [C0603]  (hidden comment: Capacitor)
C55  value 0,1мк  Voltage: 50B  [C0603]  (hidden comment: Capacitor)
C56  value 1мк  Voltage: 16B  [C0603]  (hidden comment: Capacitor)
DD4  STM32F405RGT6  [LQFP64]
DD5  Part Number: P6AU-0505ELF  [SIP4]  (hidden comment: P6AU-xxxxELF)
DD6  (no value)  [SO16]
G1  KXO  [QSMD7x5.2x1.8]
L1  Rated Current: 1,5A  [L0603]  (hidden comment: Inductor)
R46  value 10к  [R0402]  (hidden comment: Resistor_0,062Вт)
R47  value 47  [R0402]  (hidden comment: Resistor_0,062Вт)
R48  value 47  [R0402]  (hidden comment: Resistor_0,062Вт)
R49  value 47  [R0402]  (hidden comment: Resistor_0,062Вт)
R50  value 5,1к  [R0603]  (hidden comment: Resistor_0,062Вт)
R51  value 5,1к  [R0603]  (hidden comment: Resistor_0,062Вт)
R52  value 62  [R0603]  (hidden comment: Resistor_0,062Вт)
R53  value 62  [R0603]  (hidden comment: Resistor_0,062Вт)
R54  value 5,1к  [R0603]  (hidden comment: Resistor_0,062Вт)
VD2  DiodeSchottky  [SOD-323]  (value not drawn)
X3  Header_5_plg  [PLS-5]  (value not drawn)

### Ports
I_SENSE_A, I_SENSE_B, I_SENSE_C, PWM_AB, PWM_AT, PWM_BB, PWM_BT, PWM_CB, PWM_CT, V_POWER

### Nets
3,3BD: C41.2 C42.2 C53.2 C54.2 DD6.1(Vcc1) G1.4(VCC) R50.2 VD2.2(A)
5B_CAN: C50.1 C55.2 C56.2 DD5.4(Vout+) DD6.16(Vcc2)
5BD: C49.1 DD5.2(Vin+)
+3,3BA: L1.2
+3,3BD: C43.1 C44.2 C45.2 C46.2 C47.2 C48.2 DD4.1(VBAT) DD4.19(VDD) DD4.32(VDD) DD4.48(VDD) DD4.64(VDD) R46.2
AGND: C39.1 C40.2 DD4.12(VSSA)
DGND: C36.1 C37.1 C38.1 C41.1 C42.1 C43.2 C44.1 C45.1 C46.1 C47.1 C48.1 C49.2 C51.1 C53.1 C54.1 DD4.18(VSS) DD4.60(BOOT0) DD4.63(VSS) DD5.1(Vin-) DD6.2(GND1) DD6.7(GND1) DD6.8(GND1) G1.2(GND) X3.3
GND_CAN: C50.2 C51.2 C52.2 C55.1 C56.1 DD5.3(Vout-) DD6.9(GND2) DD6.10(GND2) DD6.15(GND2) R51.2 R54.1
CANH_F: DD6.13(CANH) R51.1 R52.2
CANL_F: DD6.12(CANL) R53.1 R54.2
MCU_CAN1_RX: DD4.44(PA11_/_USART1_CTS/CAN1_RX/TIM1_CH4/OTG_FS_DM/FT) DD6.3(RxD)
MCU_CAN1_TX: DD4.45(PA12_/_USART1_RTS/CAN1_TX/TIM1_ETR/OTG_FS_DP/FT) DD6.6(TxD) R50.1
MCU_RESET: C38.2 DD4.7(NRST) R46.1 R49.2
MCU_SWCLK: DD4.49(PA14_/_JTCK-SWCLK/FT) R47.2
MCU_SWDIO: DD4.46(PA13_/_JTMS-SWDIO/FT) R48.2
NetC36_2: C36.2 DD4.47(VCAP_2)
NetC37_2: C37.2 DD4.31(VCAP_1)
NetC39_2: C39.2 C40.1 DD4.13(VDDA) L1.1
NetC52_1: C52.1 R52.1 R53.2
NetC?#5_2: DD4.17(PA3_/_USART2_RX/TIM5_CH4/TIM9_CH2/TIM2_CH4/OTG_HS_ULPI_D0/ETH_MII_COL/ADC123_IN3/FT) ; port I_SENSE_A
NetC?#6_2: DD4.15(PA1_/_USART2_RTS/UART4_RX/ETH_RMII_REF_CLK/ETH_MII_RX_CLK/TIM5_CH2/TIM2_CH2/ADC123_IN1/FT) ; port I_SENSE_C
NetC?#15_2: DD4.22(PA6_/_SPI1_MISO/TIM8_BKIN/TIM13_CH1/DCMI_PIXCLK/TIM3_CH1/TIM1_BKIN/ADC12_IN6/FT) ; port I_SENSE_B
NetC?#16_2: DD4.14(PA0_/_WAKEUP/USART2_CTS/UART4_TX/ETH_MII_CRS/TIM2_CH1_ETR/TIM5_CH1/TIM8_ETR/ADC123_IN0/FT) ; port V_POWER
NetDD4_5: DD4.5(PH0_/OSC_IN/FT) G1.3(DCLK)
NetDD4_27: DD4.27(PB1_/_TIM3_CH4/TIM8_CH3N/OTG_HS_ULPI_D2/ETH_MII_RXD3/TIM1_CH3N/ADC12_IN9/FT) ; port PWM_AT
NetDD4_30: DD4.30(PB11_/_I2C2_SDA/USART3_RX/OTG_HS_ULPI_D4/ETH_RMII_TX_EN/ETH_MII_TX_EN/TIM2_CH4/FT) ; port PWM_CB
NetDD4_55: DD4.55(PB3_/_JTDO/TRACESWO/SPI3_SCK/I2S3_CK/TIM2_CH2/SPI1_SCK/FT) ; port PWM_AB
NetDD4_57: DD4.57(PB5_/_I2C1_SMBA/CAN2_RX/OTG_HS_ULPI_D7/ETH_PPS_OUT/TIM3_CH2/SPI1_MOSI/SPI3_MOSI/DCMI_D10/I2S3_SD/FT) ; port PWM_BT
NetDD4_59: DD4.59(PB7_/_I2C1_SDA/FSMC_NL/DCMI_VSYNC/USART1_RX/TIM4_CH2/FT) ; port PWM_BB
NetDD4_62: DD4.62(PB9_/_SPI2_NSS/I2S2_WS/TIM4_CH4/TIM11_CH1/SDIO_D5/DCMI_D7/I2C1_SDA/CAN1_TX/FT) ; port PWM_CT
NetR47_1: R47.1 X3.2
NetR48_1: R48.1 X3.4
NetR49_1: R49.1 X3.5
NetVD2_1: VD2.1(K) X3.1

Not connected (* = marked no-connect by the designer): DD4 2(PC13_/_EVENTOUT/RTC_OUT/RTC_TAMP1/RTC_TS/FT) 3(PC14_/_OSC32_IN/FT) 4(PC15_/_OSC32_OUT/FT) 6(PH1_/OSC_OUT/FT)* 8(PC0_/_OTG_HS_ULPI_STP/EVENTOUT/ADC123_IN10/FT) 9(PC1_/_ETH_MDC/EVENTOUT/ADC123_IN11/FT) 10(PC2_/_SPI2_MISO/OTG_HS_ULPI_DIR/ETH_MII_TXD2/I2S2ext_SD/ADC123_IN12/FT) 11(PC3_/_SPI2_MOSI/I2S2_SD/OTG_HS_ULPI_NXT/ETH_MII_TX_CLK/ADC123_IN13/FT) 16(PA2_/_USART2_TX/TIM5_CH3/ADC123_IN2/TIM9_CH1/TIM2_CH3/ADC123_IN2/FT) 20(PA4_/_SPI1_NSS/SPI3_NSS/USART2_CK/DCMI_HSYNC/OTG_HS_SOF/I2S3_WS/ADC12_IN4/DAC_OUT1/TTa) 21(PA5_/_SPI1_SCK/OTG_HS_ULPI_CK/TIM2_CH1_ETR/TIM8_CH1N/ADC12_IN5/DAC_OUT2/TTa) 23(PA7_/_SPI1_MOSI/TIM8_CH1N/TIM14_CH1/TIM3_CH2/ETH_MII_RX_DV/TIM1_CH1N/ETH_RMII_CRS_DV/ADC12_IN7/FT) 24(PC4_/_ETH_RMII_RX_D0/ETH_MII_RX_D0/ADC12_IN14/FT) 25(PC5_/_ETH_RMII_RX_D1/ETH_MII_RX_D1/ADC12_IN15/FT) 26(PB0_/_TIM3_CH3/TIM8_CH2N/OTG_HS_ULPI_D1/ETH_MII_RXD2/TIM1_CH2N/ADC12_IN8/FT) 28(PB2_/_BOOT1/FT) 29(PB10_/_SPI2_SCK/I2S2_CK/I2C2_SCL/USART3_TX/OTG_HS_ULPI_D3/ETH_MII_RX_ER/TIM2_CH3/FT) 33(PB12_/_SPI2_NSS/I2S2_WS/I2C2_SMBA/USART3_CK/TIM1_BKIN/CAN2_RX_/OTG_HS_ULPI_D5/ETH_RMII_TXD0/ETH_MII_TXD0/OTG_HS_ID/FT) 34(PB13_/_SPI2_SCK/I2S2_CK/USART3_CTS/TIM1_CH1N/CAN2_TX/OTG_HS_ULPI_D6/ETH_RMII_TXD1/ETH_MII_TXD1/OTG_HS_VBUS/FT) 35(PB14_/_SPI2_MISO/TIM1_CH2N/TIM12_CH1/OTG_HS_DM/USART3_RTS/TIM8_CH2N/I2S2ext_SD/FT) 36(PB15_/_SPI2_MOSI/I2S2_SD/TIM1_CH3N/TIM8_CH3N/TIM12_CH2/OTG_HS_DP/RTC_REFIN/FT) 37(PC6_/_I2S2_MCK/TIM8_CH1/SDIO_D6/USART6_TX/DCMI_D0/TIM3_CH1/FT) 38(PC7_/_I2S3_MCK/TIM8_CH2/SDIO_D7/USART6_RX/DCMI_D1/TIM3_CH2/FT) 39(PC8_/_TIM8_CH3/SDIO_D0/TIM3_CH3/USART6_CK/DCMI_D2/FT) 40(PC9_/_I2S_CKIN/MCO2/TIM8_CH4/SDIO_D1/I2C3_SDA/DCMI_D3/TIM3_CH4/FT) 41(PA8_/_MCO1/USART1_CK/TIM1_CH1/I2C3_SCL/OTG_FS_SOF/FT) 42(PA9_/_USART1_TX/TIM1_CH2/I2C3_SMBA/DCMI_D0/OTG_FS_VBUS/FT) 43(PA10_/_USART1_RX/TIM1_CH3/OTG_FS_ID/DCMI_D1/FT) 50(A15_/_JTDI/SPI3_NSS/I2S3_WS/TIM2_CH1_ETR/_SPI1_NSS/FT) 51(PC10_/_SPI3_SCK/I2S3_CK/UART4_TX/SDIO_D2/DCMI_D8/USART3_TX/FT) 52(PC11_/_UART4_RX/SPI3_MISO/SDIO_D3/DCMI_D4/USART3_RX/I2S3ext_SD/FT) 53(PC12_/_UART5_TX/SDIO_CK/DCMI_D9/SPI3_MOSI/I2S3_SD/USART3_CK/FT) 54(PD2_/_TIM3_ETR/UART5_RX/SDIO_CMD/DCMI_D11/FT) 56(PB4_/_NJTRST/SPI3_MISO/TIM3_CH1/SPI1_MISO/I2S3ext_SD/FT) 58(PB6_/_I2C1_SCL/TIM4_CH1/CAN2_TX/DCMI_D5/USART1_TX/FT) 61(PB8_/_TIM4_CH3/SDIO_D4/TIM10_CH1/DCMI_D6/ETH_MII_TXD3/I2C1_SCL/CAN1_RX/FT); DD6 4(NC)* 5(NC)* 11(NC)* 14(NC)*; G1 1(NC)*

### Notes on the sheet
- На лист 2
- На лист 3
- (near X3) Программатор
- Акселерометр LIS2HH12
- Линия CAN для передней части
- Подп. и дата
- Энкодер на вращение модуля
- Инв. № дубл.
- Взам. инв. №
- Общее потребление: 76 mA + 200 mA + 150 mA + 200 mA = 700 mA
- Инв. № подл.
- Лист
- Изм.
- № докум.
- Подп.
- Дата
- Копировал
- Формат
- (in symbol connect6) Цепь
- (in symbol crystal10) G
- (in symbol interf22) RTX
- (in symbol microcont10) MPU
- (in symbol pwr52) DC-DC

### Library data of the parts
C36 C37 = cap134: Конденсатор; Part Name: Ceramic; Manufacture: Murata; Part Number: GRM188R71A225KE15D; id: cap134; TKE: X7R
C38 C39 C41 C44-C48 = cap277: as C?#7 on sheet DriverBoard_Amp
C40 C43 C49 C50 = cap199: Конденсатор полярный; Part Name: Tantal; Manufacture: Vishay; Part Number: 293D106X9016A2TE3; id: cap199
C42 C53 C56 = cap133: Конденсатор; Part Name: Ceramic; Manufacture: Murata; Part Number: GRM188R71C105KA12D**; id: cap133; TKE: X7R
C51 = cap276: Конденсатор; Part Name: Film; Manufacture: Россия; Part Number: К78-2-1200пФ-1600В,10%; id: cap276; tga: 0,10%
C52 = cap124: Конденсатор; Part Name: Ceramic; Manufacture: Murata; Part Number: GRM188R71H103K; id: cap124; TKE: X7R
C54 C55 = cap131: Конденсатор; Part Name: Ceramic; Manufacture: Murata; Part Number: GRM188R71H104KA93D; id: cap131; TKE: X7R
DD4 = microcont10: Part Name: Microcontroller; Frequency: 168MHz; ADC: 16x12b/2x12b; Interface: can, i2c, irda, lin, spi, uart, usbotg,sdio; Flash: 1Mb; Pin in: 51; Power Supply: 1.8-3.6V; id: microcont10; Part Number: STM32F405RGT6
DD5 = pwr52: DC/DC преобразователь; Part Name: DC/DC Converter Isolated; Manufacturer: PEAK Electronics; id: pwr52; Input Voltage: 5B; Current: 200mA; Type: Isolated; Output Voltage: 5B
DD6 = interf22: Isolated CAN Transceiver; Manufacture: Texas Instruments; Number of Channel: 1; Type Supply: Single Polar; Current Consumption: 76mA; Power Supply: 3-5,5В/4,75-5,25В; id: interf22; Part Name: Isolated CAN Transceiver; Part Number: ISO1050DW
G1 = crystal10: Кварц. генер. 32.768 МГц (HCMOS/TTL); Manufacture: GEYER; Part Number: KXO-V97; Frequence: 12MHz; id: crystal10
L1 = ind0: EMI Suppression Filter; Part Name: EMI Suppression Filters; Part Number: BLM18PG181SN1D; id: ind0; Resistance: 0,09Ohm
R46 = res294: as R?#31 on sheet DriverBoard_Driver; Part Name: Resistor; Power: 0,062Вт
R47-R49 = res238: Резистор; Manufacture: Yageo; Part Number: RC0402FR-0747RL; id: res238; Accuracy: 0,01; Part Name: Resistor; Power: 0,062Вт
R50 R51 R54 = res480: Резистор; Manufacture: Yageo; Part Number: RC0603FR-075K1; id: res480; Accuracy: 0,01; Part Name: Resistor; Power: 0,062Вт
R52 R53 = res434: Резистор; Manufacture: Yageo; Part Number: RC0603FR-0762RL; id: res434; Accuracy: 0,01; Part Name: Resistor; Power: 0,062Вт
VD2 = diode19: Диод Шоттки; Part Number: PMEG4010BEA.115; Manufacture: NXP Semiconductor; Max Reverse Voltage: 40B; Forward Voltage: 0,64B; Forward Current: 10mA; Capacitance: 50pF; Number of Channels: 1; id: diode19; Part Name: Diode Schottky
X3 = connect6: Разъем - 5 конт. вилка; Part Number: DS1021-1*5SF112-B; Manufacture: Ningbo connfly electronic; Contact_1: +3,3B; Contact_2: SWCLK; Contact_3: GND; Contact_4: SWDIO; Contact_5: RESET; Etch: 2,54mm; Part Name: PLS-5; id: connect6

## Sheet DriverBoard_DC.SchDoc
size 594 x 420 mm; DocumentNumber: Введите номер платы + Э3; SheetNumber: номер страницы; Format: A2
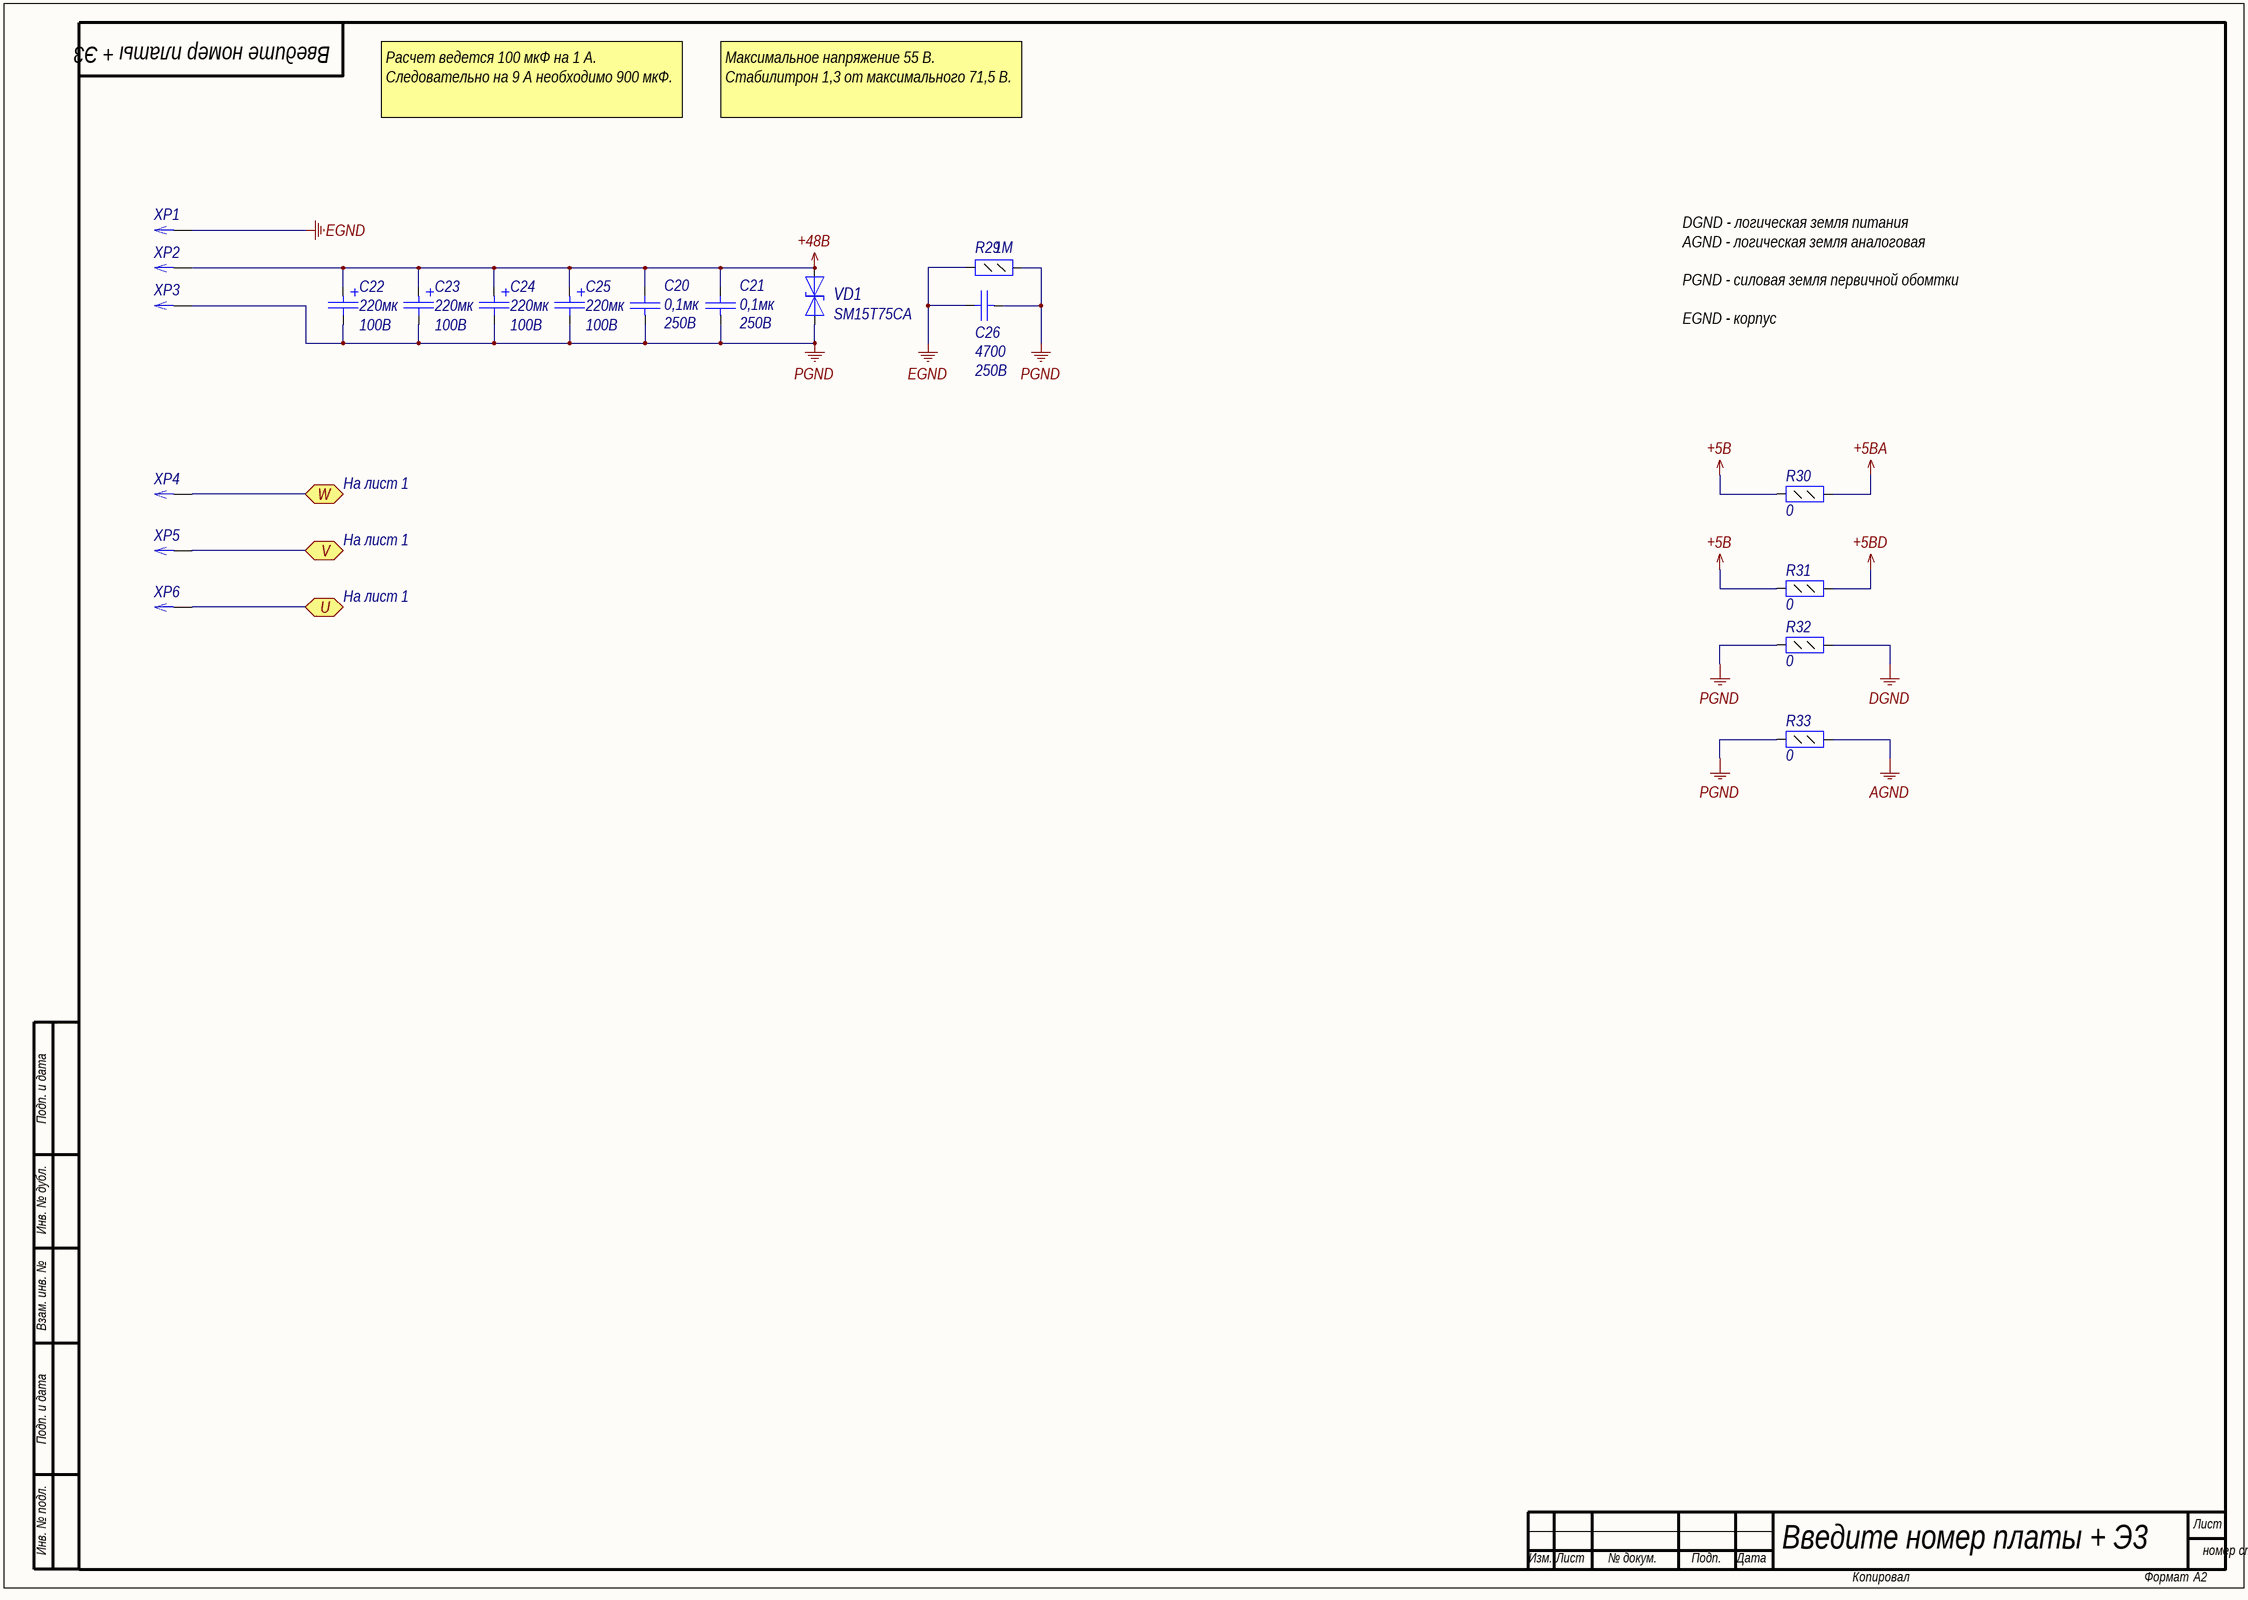
[diagram p4: DriverBoard_DC.SchDoc]

### Parts
C20  value 0,1мк  Voltage: 250В  [C1206]  (hidden comment: Capacitor)
C21  value 0,1мк  Voltage: 250В  [C1206]  (hidden comment: Capacitor)
C22  value 220мк  Voltage: 100B  [K50-35(12.5X25)_V]  (hidden comment: Capacitor_pol)
C23  value 220мк  Voltage: 100B  [K50-35(12.5X25)_V]  (hidden comment: Capacitor_pol)
C24  value 220мк  Voltage: 100B  [K50-35(12.5X25)_V]  (hidden comment: Capacitor_pol)
C25  value 220мк  Voltage: 100B  [K50-35(12.5X25)_V]  (hidden comment: Capacitor_pol)
C26  value 4700  Voltage: 250В  [C0805]  (hidden comment: Capacitor)
R29  value 1М  [R0805]  (hidden comment: Resistor_0,125Вт)
R30  value 0  [R0805]  (hidden comment: Resistor_0,125Вт)
R31  value 0  [R0805]  (hidden comment: Resistor_0,125Вт)
R32  value 0  [R0805]  (hidden comment: Resistor_0,125Вт)
R33  value 0  [R0805]  (hidden comment: Resistor_0,125Вт)
VD1  Part Number: SM15T75CA  [SMC]  (hidden comment: DiodeZenerDual)
XP1  Header_1_sct  [pin_ESKD]  (value not drawn)
XP2  Header_1_sct  [pin_ESKD]  (value not drawn)
XP3  Header_1_sct  [pin_ESKD]  (value not drawn)
XP4  Header_1_sct  [pin_ESKD]  (value not drawn)
XP5  Header_1_sct  [pin_ESKD]  (value not drawn)
XP6  Header_1_sct  [pin_ESKD]  (value not drawn)

### Ports
U, V, W

### Nets
+5B: R30.1 R31.1
+5BA: R30.2
+5BD: R31.2
+48B: C20.2 C21.2 C22.1 C23.1 C24.1 C25.1 VD1.2(A) XP2.1
AGND: R33.2
DGND: R32.2
EGND: C26.2 R29.2 XP1.1
PGND: C20.1 C21.1 C22.2 C23.2 C24.2 C25.2 C26.1 R29.1 R32.1 R33.1 VD1.1(K) XP3.1
NetC?#20_2: XP6.1 ; port U
NetC?#23_2: XP5.1 ; port V
NetC?#26_2: XP4.1 ; port W

### Notes on the sheet
- Расчет ведется 100 мкФ на 1 А.
  Следовательно на 9 А необходимо 900 мкФ.
- Максимальное напряжение 55 В.
  Стабилитрон 1,3 от максимального 71,5 В.
- DGND - логическая земля питания
  AGND - логическая земля аналоговая
  PGND - силовая земля первичной обомтки
  EGND - корпус
- На лист 1
- Подп. и дата
- Инв. № дубл.
- Взам. инв. №
- Инв. № подл.
- Лист
- Изм.
- № докум.
- Подп.
- Дата
- Копировал
- Формат

### Library data of the parts
C20 C21 = cap179: Конденсатор; Part Name: Ceramic; Manufacture: Murata; Part Number: GRM31CR72E104K; id: cap179; TKE: X7R
C22-C25 = cap279: Конденсатор полярный; Part Name: Electrolit; Manufacture: Epcos; Part Number: B41851A9227M000; id: cap279; tga: 0,10%; ESR: 75мОм; Iac max: 0,4А; Iac rated: 0,6А
C26 = cap211: Конденсатор; Part Name: Ceramic; Manufacture: Murata; Part Number: GRM21AR72E472KW; id: cap211; TKE: X7R
R29 = res149: Резистор; Manufacture: Yageo; Part Number: RC0805FR-071ML; id: res149; Accuracy: 0,01; Part Name: Resistor; Power: 0,125Вт
R30-R33 = res0: Резистор; Manufacture: Yageo; Part Number: RC0805FR-070RL; id: res0; Accuracy: 0,01; Part Name: Resistor; Power: 0,125Вт
VD1 = SM15T75CA: Cтабилитрон (диод выпрямительный лавинный) двусторонний; Part Name: TVS diode Bidirectional; Manufacture: ST Microelectronics; id: tvs280; Leakage Current: 0.2uA; Stand-off Voltage: 71.3B; Breakdown Voltage: 75B; Clamping voltage: 78.8B; Peak Pulse Power: 1500W; Number of diodes: 1
XP1-XP6 = gconnect0: Штырь ГОСТ21.614-88; Part Name: pin 11,5; id: gconnect0

## Nets that join several sheets
+5BA: DriverBoard_Amp (8 pins), DriverBoard_DC (R30.2)
+48B: DriverBoard_Bridge (R?#1.2 VT?#1.2 VT?#2.2 VT?#3.2), DriverBoard_DC (8 pins)
AGND: DriverBoard_Amp (17 pins), DriverBoard_MCU (C39.1 C40.2 DD4.12), DriverBoard_DC (R33.2)
DGND: DriverBoard_Driver (6 pins), DriverBoard_MCU (24 pins), DriverBoard_DC (R32.2)
EGND: DriverBoard_Bridge (6 pins), DriverBoard_DC (C26.2 R29.2 XP1.1)
PGND: DriverBoard_Bridge (7 pins), DriverBoard_Amp (R?#9.1 R?#11.1 R?#19.1 R?#21.1), DriverBoard_Driver (9 pins), DriverBoard_DC (12 pins)
NetC?#5_2: DriverBoard_Amp (C?#5.2 R?#13.2), DriverBoard_MCU (DD4.17)
NetC?#6_2: DriverBoard_Amp (C?#6.2 R?#14.2), DriverBoard_MCU (DD4.15)
NetC?#15_2: DriverBoard_Amp (C?#15.2 R?#23.2), DriverBoard_MCU (DD4.22)
NetC?#16_2: DriverBoard_Amp (C?#16.2 R?#24.2), DriverBoard_MCU (DD4.14)
NetC?#20_2: DriverBoard_Bridge (VT?#1.3 VT?#4.2), DriverBoard_Driver (C?#20.2 DD?#1.4), DriverBoard_DC (XP6.1)
NetC?#23_2: DriverBoard_Bridge (VT?#2.3 VT?#5.2), DriverBoard_Driver (C?#23.2 DD?#2.4), DriverBoard_DC (XP5.1)
NetC?#26_2: DriverBoard_Bridge (VT?#3.3 VT?#6.2), DriverBoard_Driver (C?#26.2 DD?#3.4), DriverBoard_DC (XP4.1)
NetDD4_27: DriverBoard_Driver (DD?#1.5 R?#31.2), DriverBoard_MCU (DD4.27)
NetDD4_30: DriverBoard_Driver (DD?#3.6 R?#40.2), DriverBoard_MCU (DD4.30)
NetDD4_55: DriverBoard_Driver (DD?#1.6 R?#32.2), DriverBoard_MCU (DD4.55)
NetDD4_57: DriverBoard_Driver (DD?#2.5 R?#35.2), DriverBoard_MCU (DD4.57)
NetDD4_59: DriverBoard_Driver (DD?#2.6 R?#36.2), DriverBoard_MCU (DD4.59)
NetDD4_62: DriverBoard_Driver (DD?#3.5 R?#39.2), DriverBoard_MCU (DD4.62)
NetR?#1_1: DriverBoard_Bridge (R?#1.1 R?#2.2), DriverBoard_Amp (R?#26.1)
NetR?#3_2: DriverBoard_Bridge (R?#3.2 R?#4.2 VT?#4.3), DriverBoard_Amp (R?#15.1)
NetR?#5_2: DriverBoard_Bridge (R?#5.2 R?#6.2 VT?#5.3), DriverBoard_Amp (R?#25.1)
NetR?#7_2: DriverBoard_Bridge (R?#7.2 R?#8.2 VT?#6.3), DriverBoard_Amp (R?#16.1)
NetR?#29_2: DriverBoard_Bridge (VT?#1.1), DriverBoard_Driver (R?#29.2)
NetR?#30_2: DriverBoard_Bridge (VT?#4.1), DriverBoard_Driver (R?#30.2)
NetR?#33_2: DriverBoard_Bridge (VT?#2.1), DriverBoard_Driver (R?#33.2)
NetR?#34_2: DriverBoard_Bridge (VT?#5.1), DriverBoard_Driver (R?#34.2)
NetR?#37_2: DriverBoard_Bridge (VT?#3.1), DriverBoard_Driver (R?#37.2)
NetR?#38_2: DriverBoard_Bridge (VT?#6.1), DriverBoard_Driver (R?#38.2)